# EasyEDA schematic SCH_AiO V4 Standard_2023-06-19.json

## Sheets
1 MAIN: TITLE: Sheet_1; REV: 1.0; Date: 2023-03-03; Sheet: 1/1; Drawn By: Richard Klasens; Company: Your Company
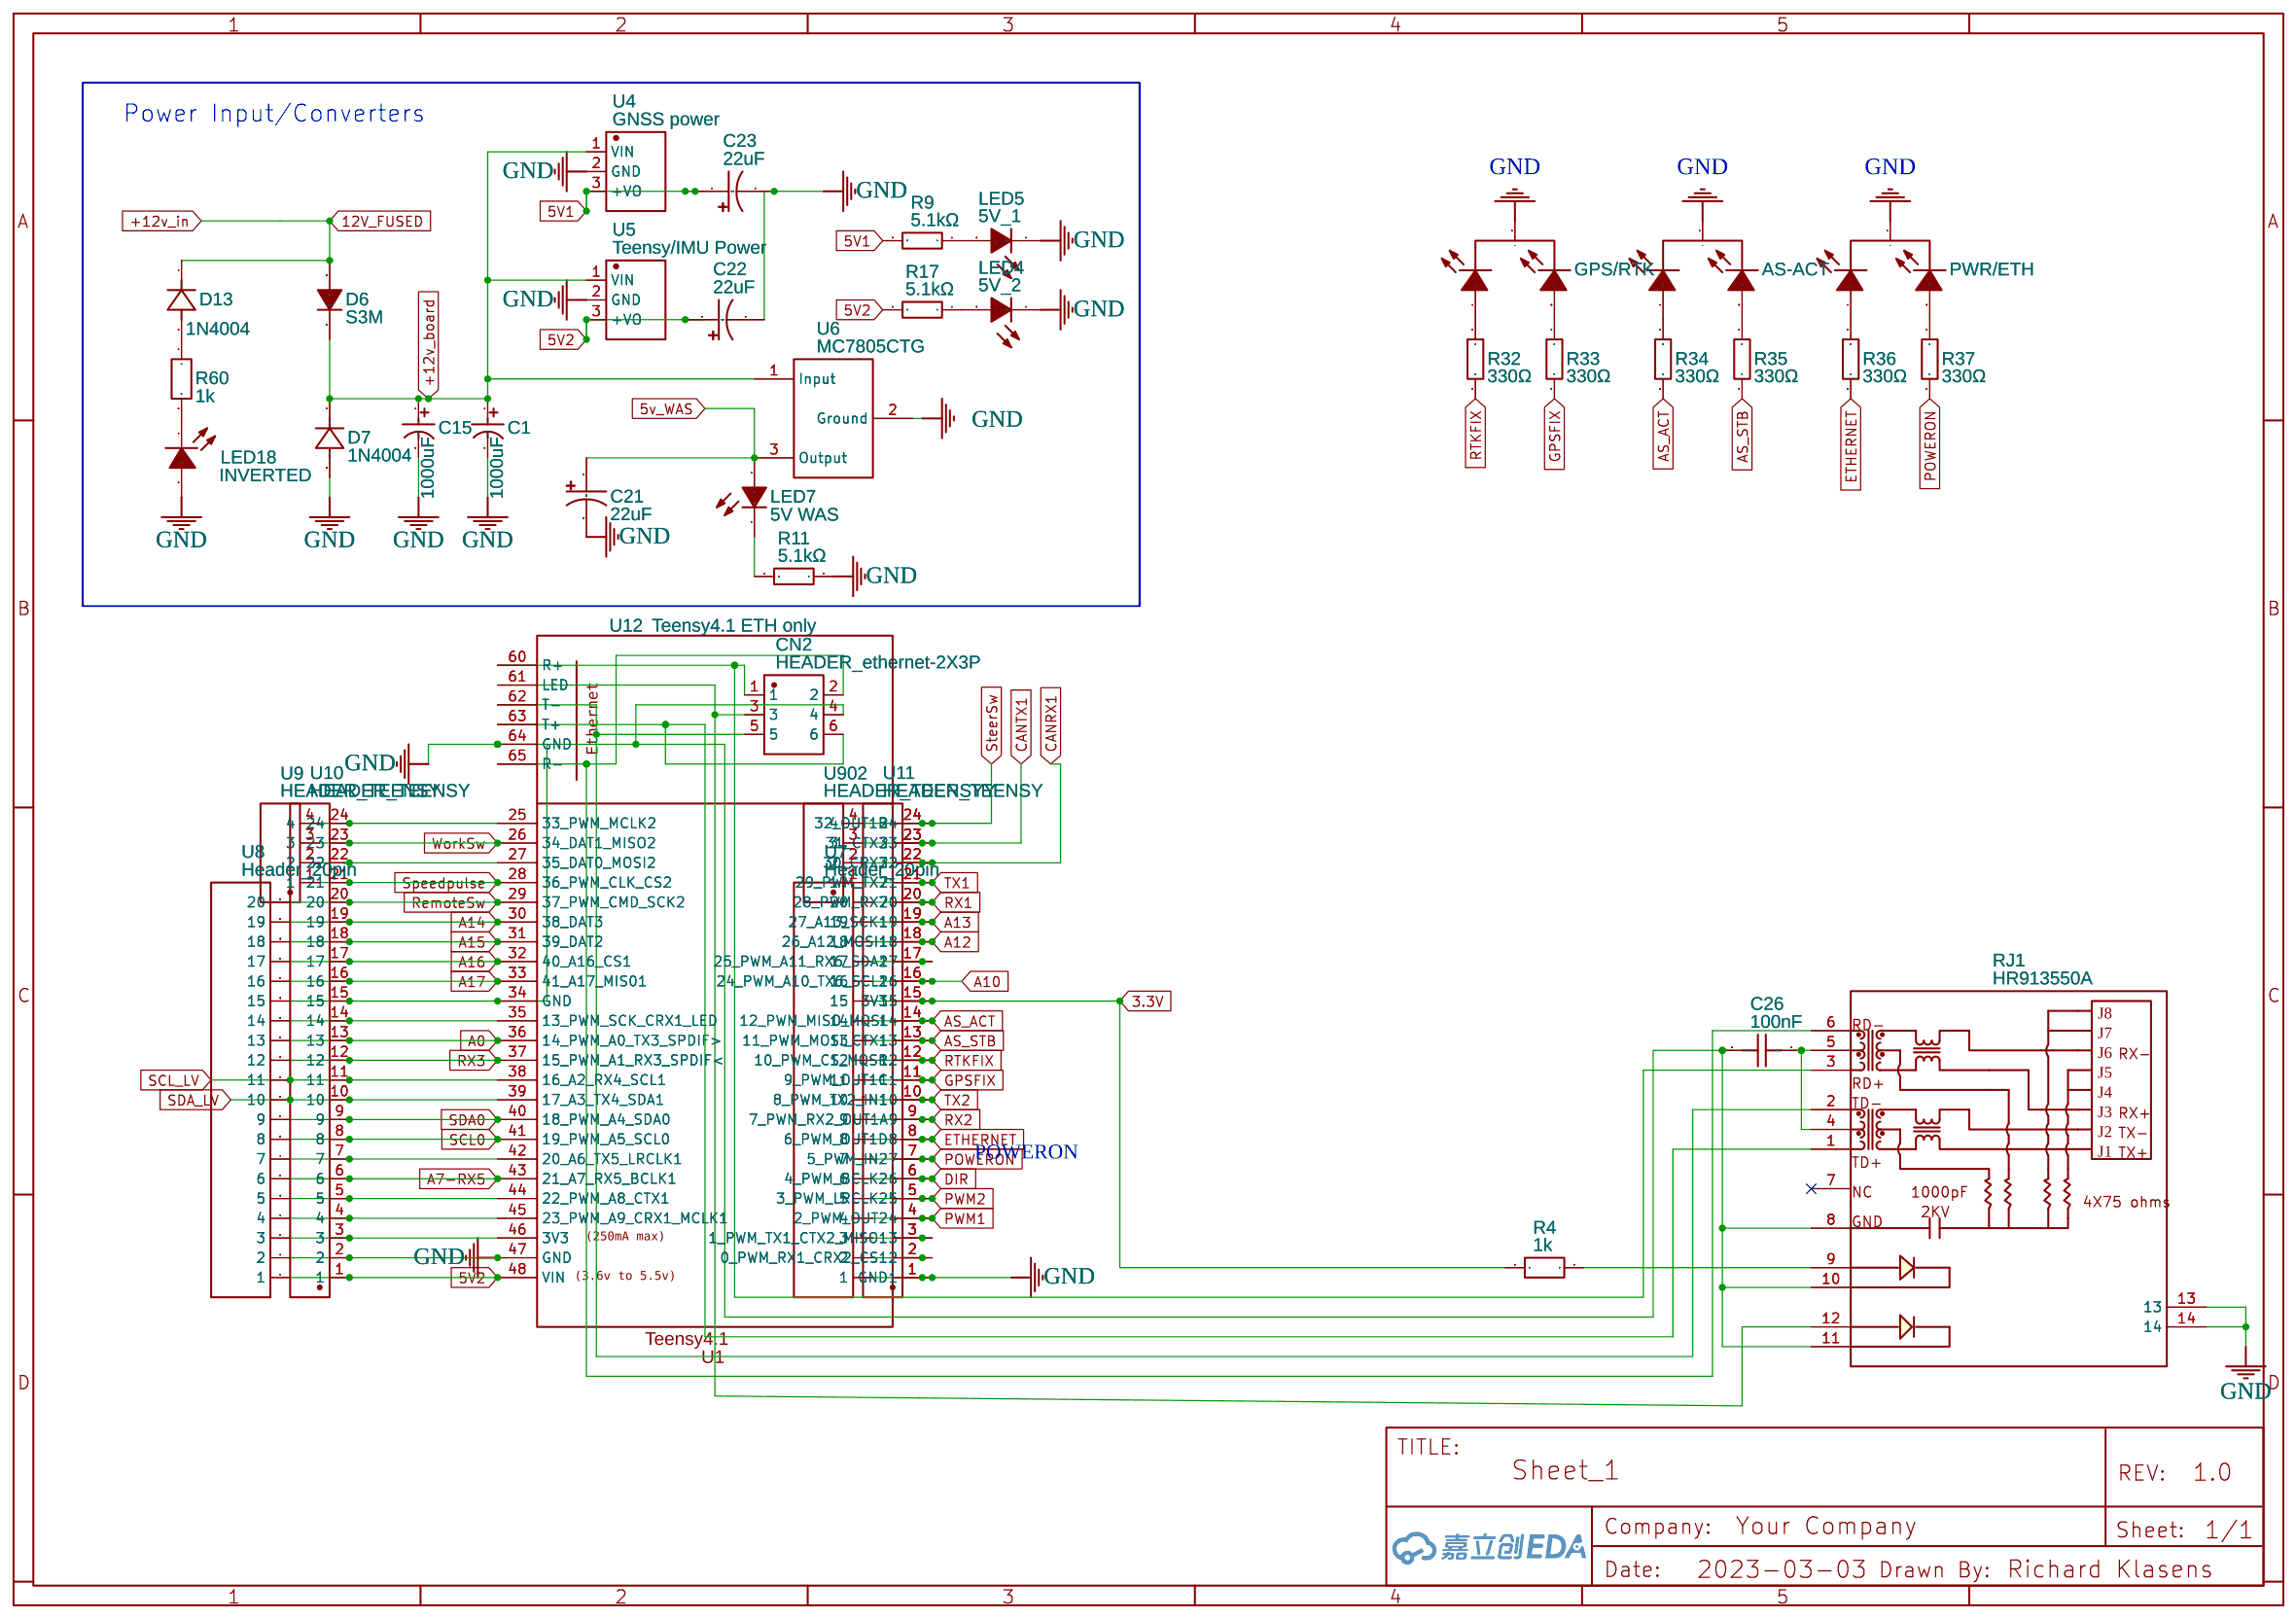
[diagram p0: MAIN]
2 WAS
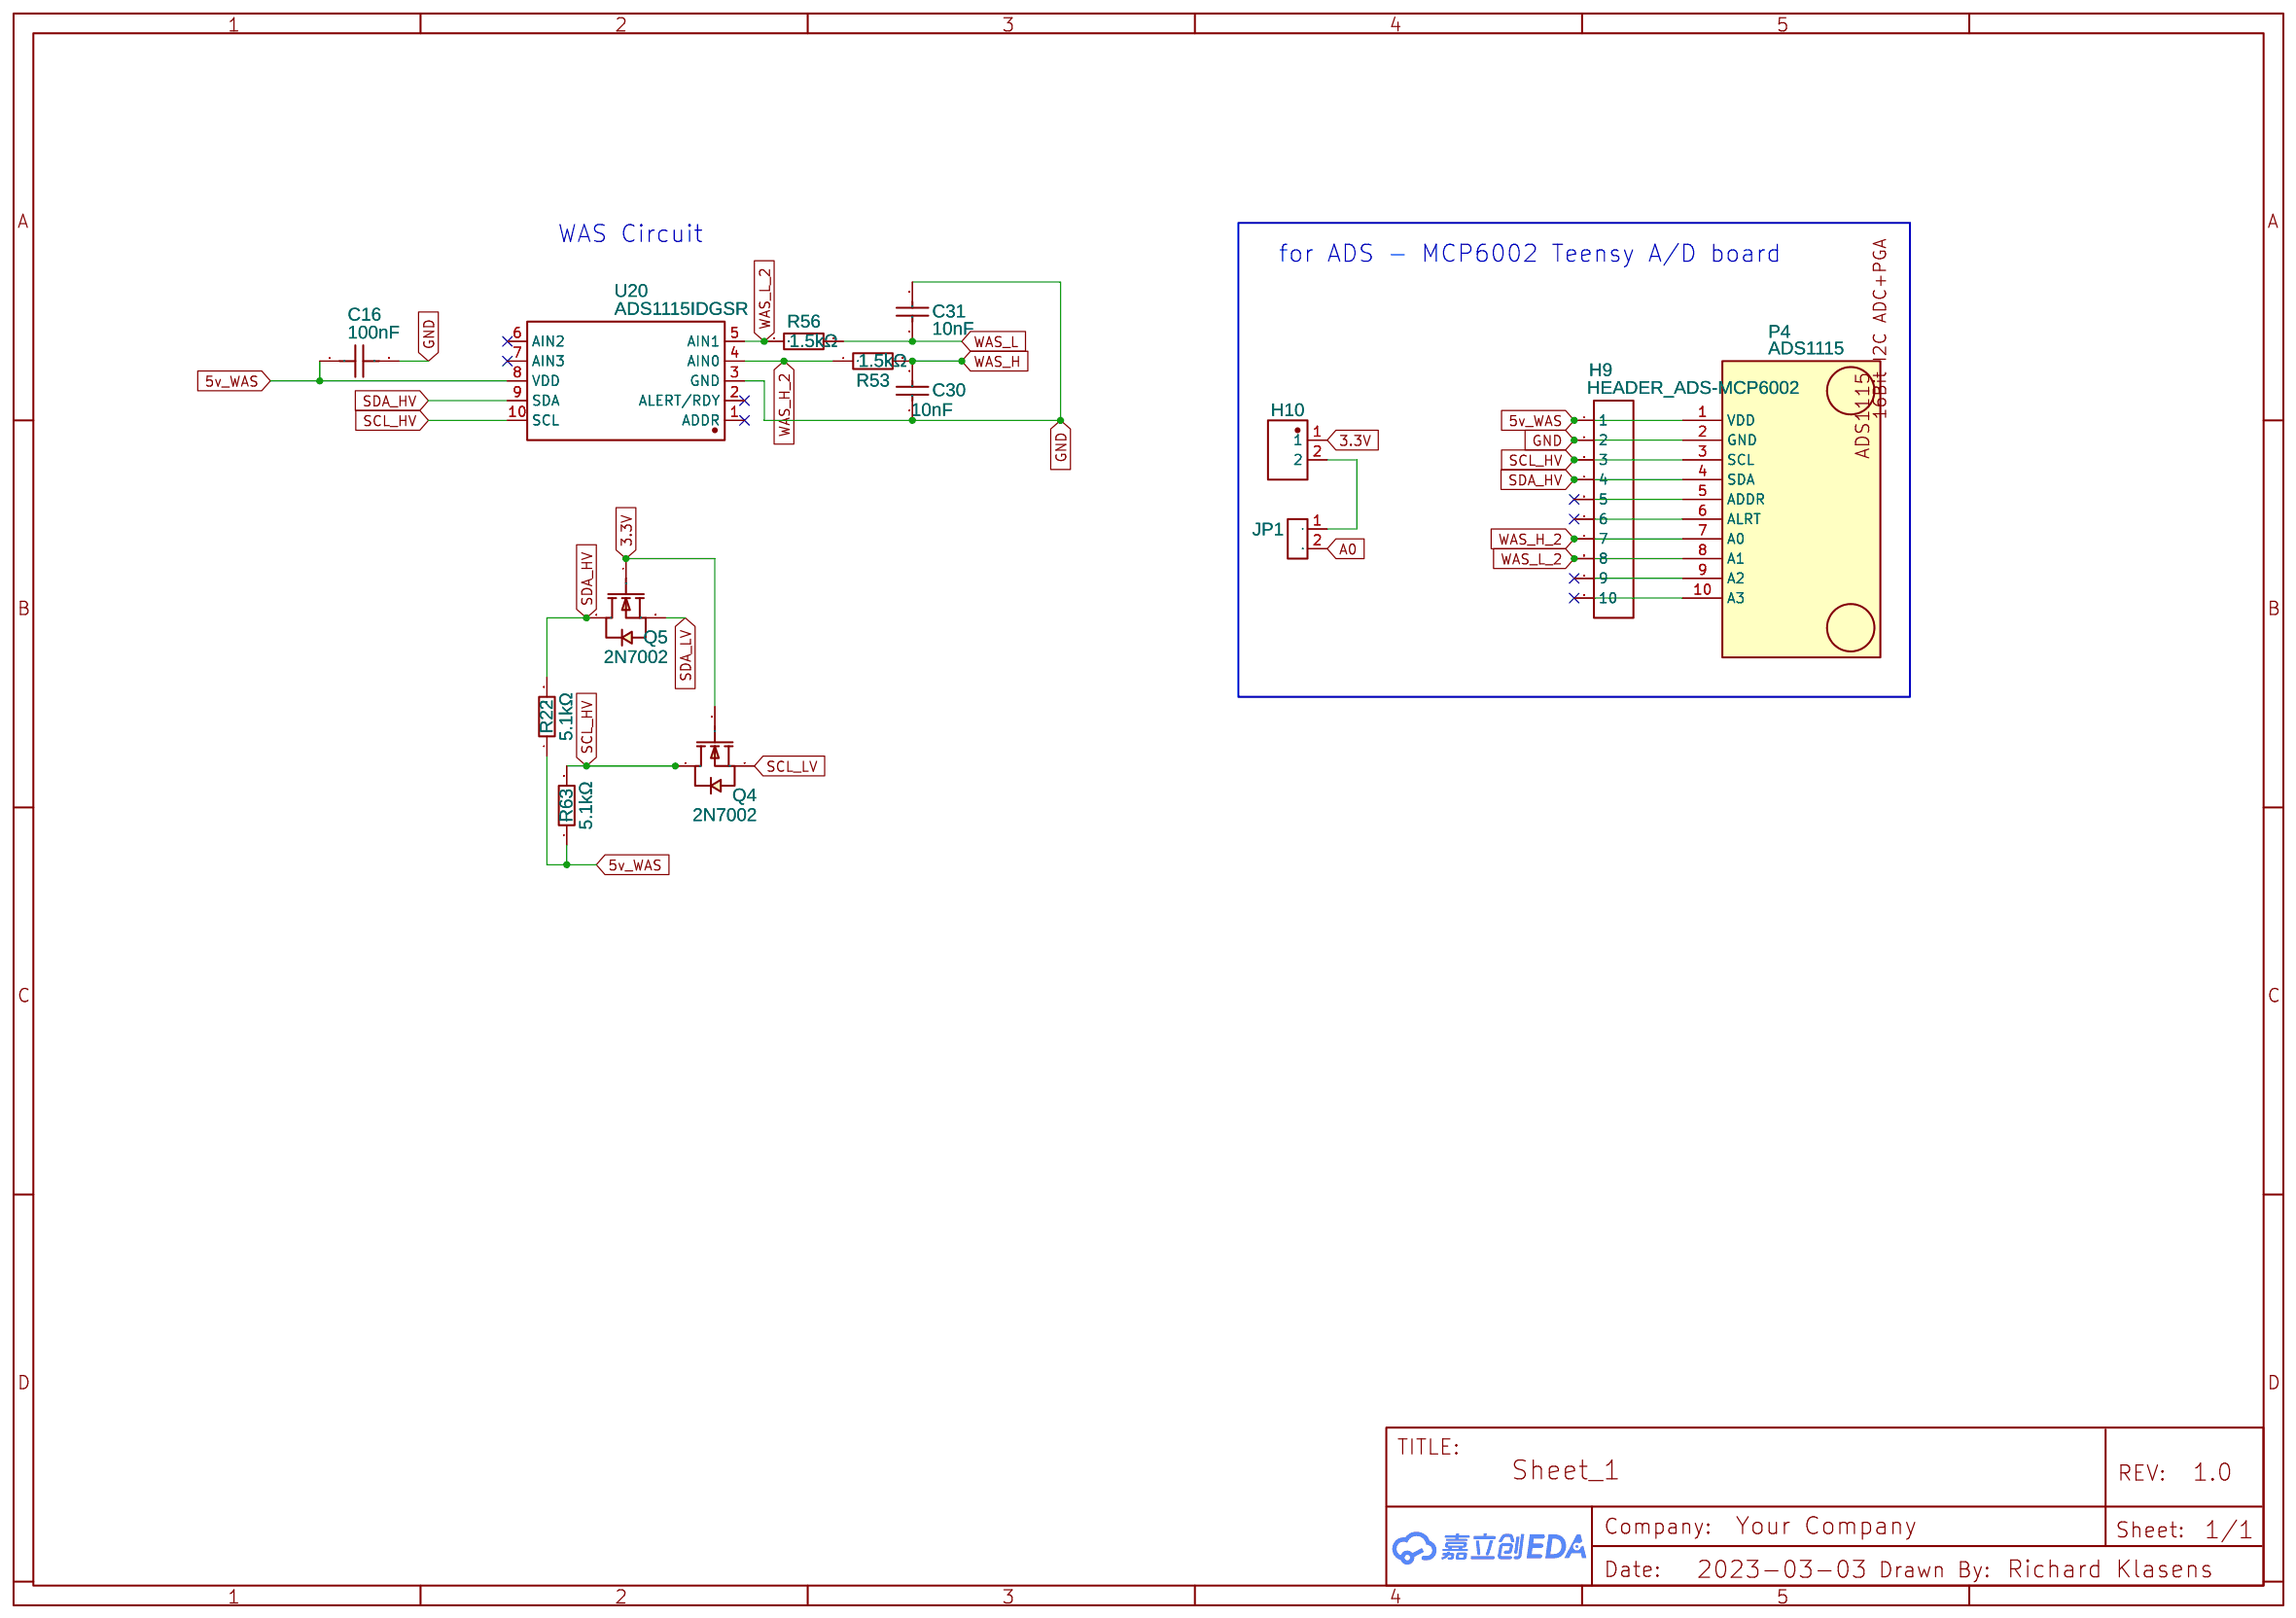
[diagram p1: WAS]
3 STEERING
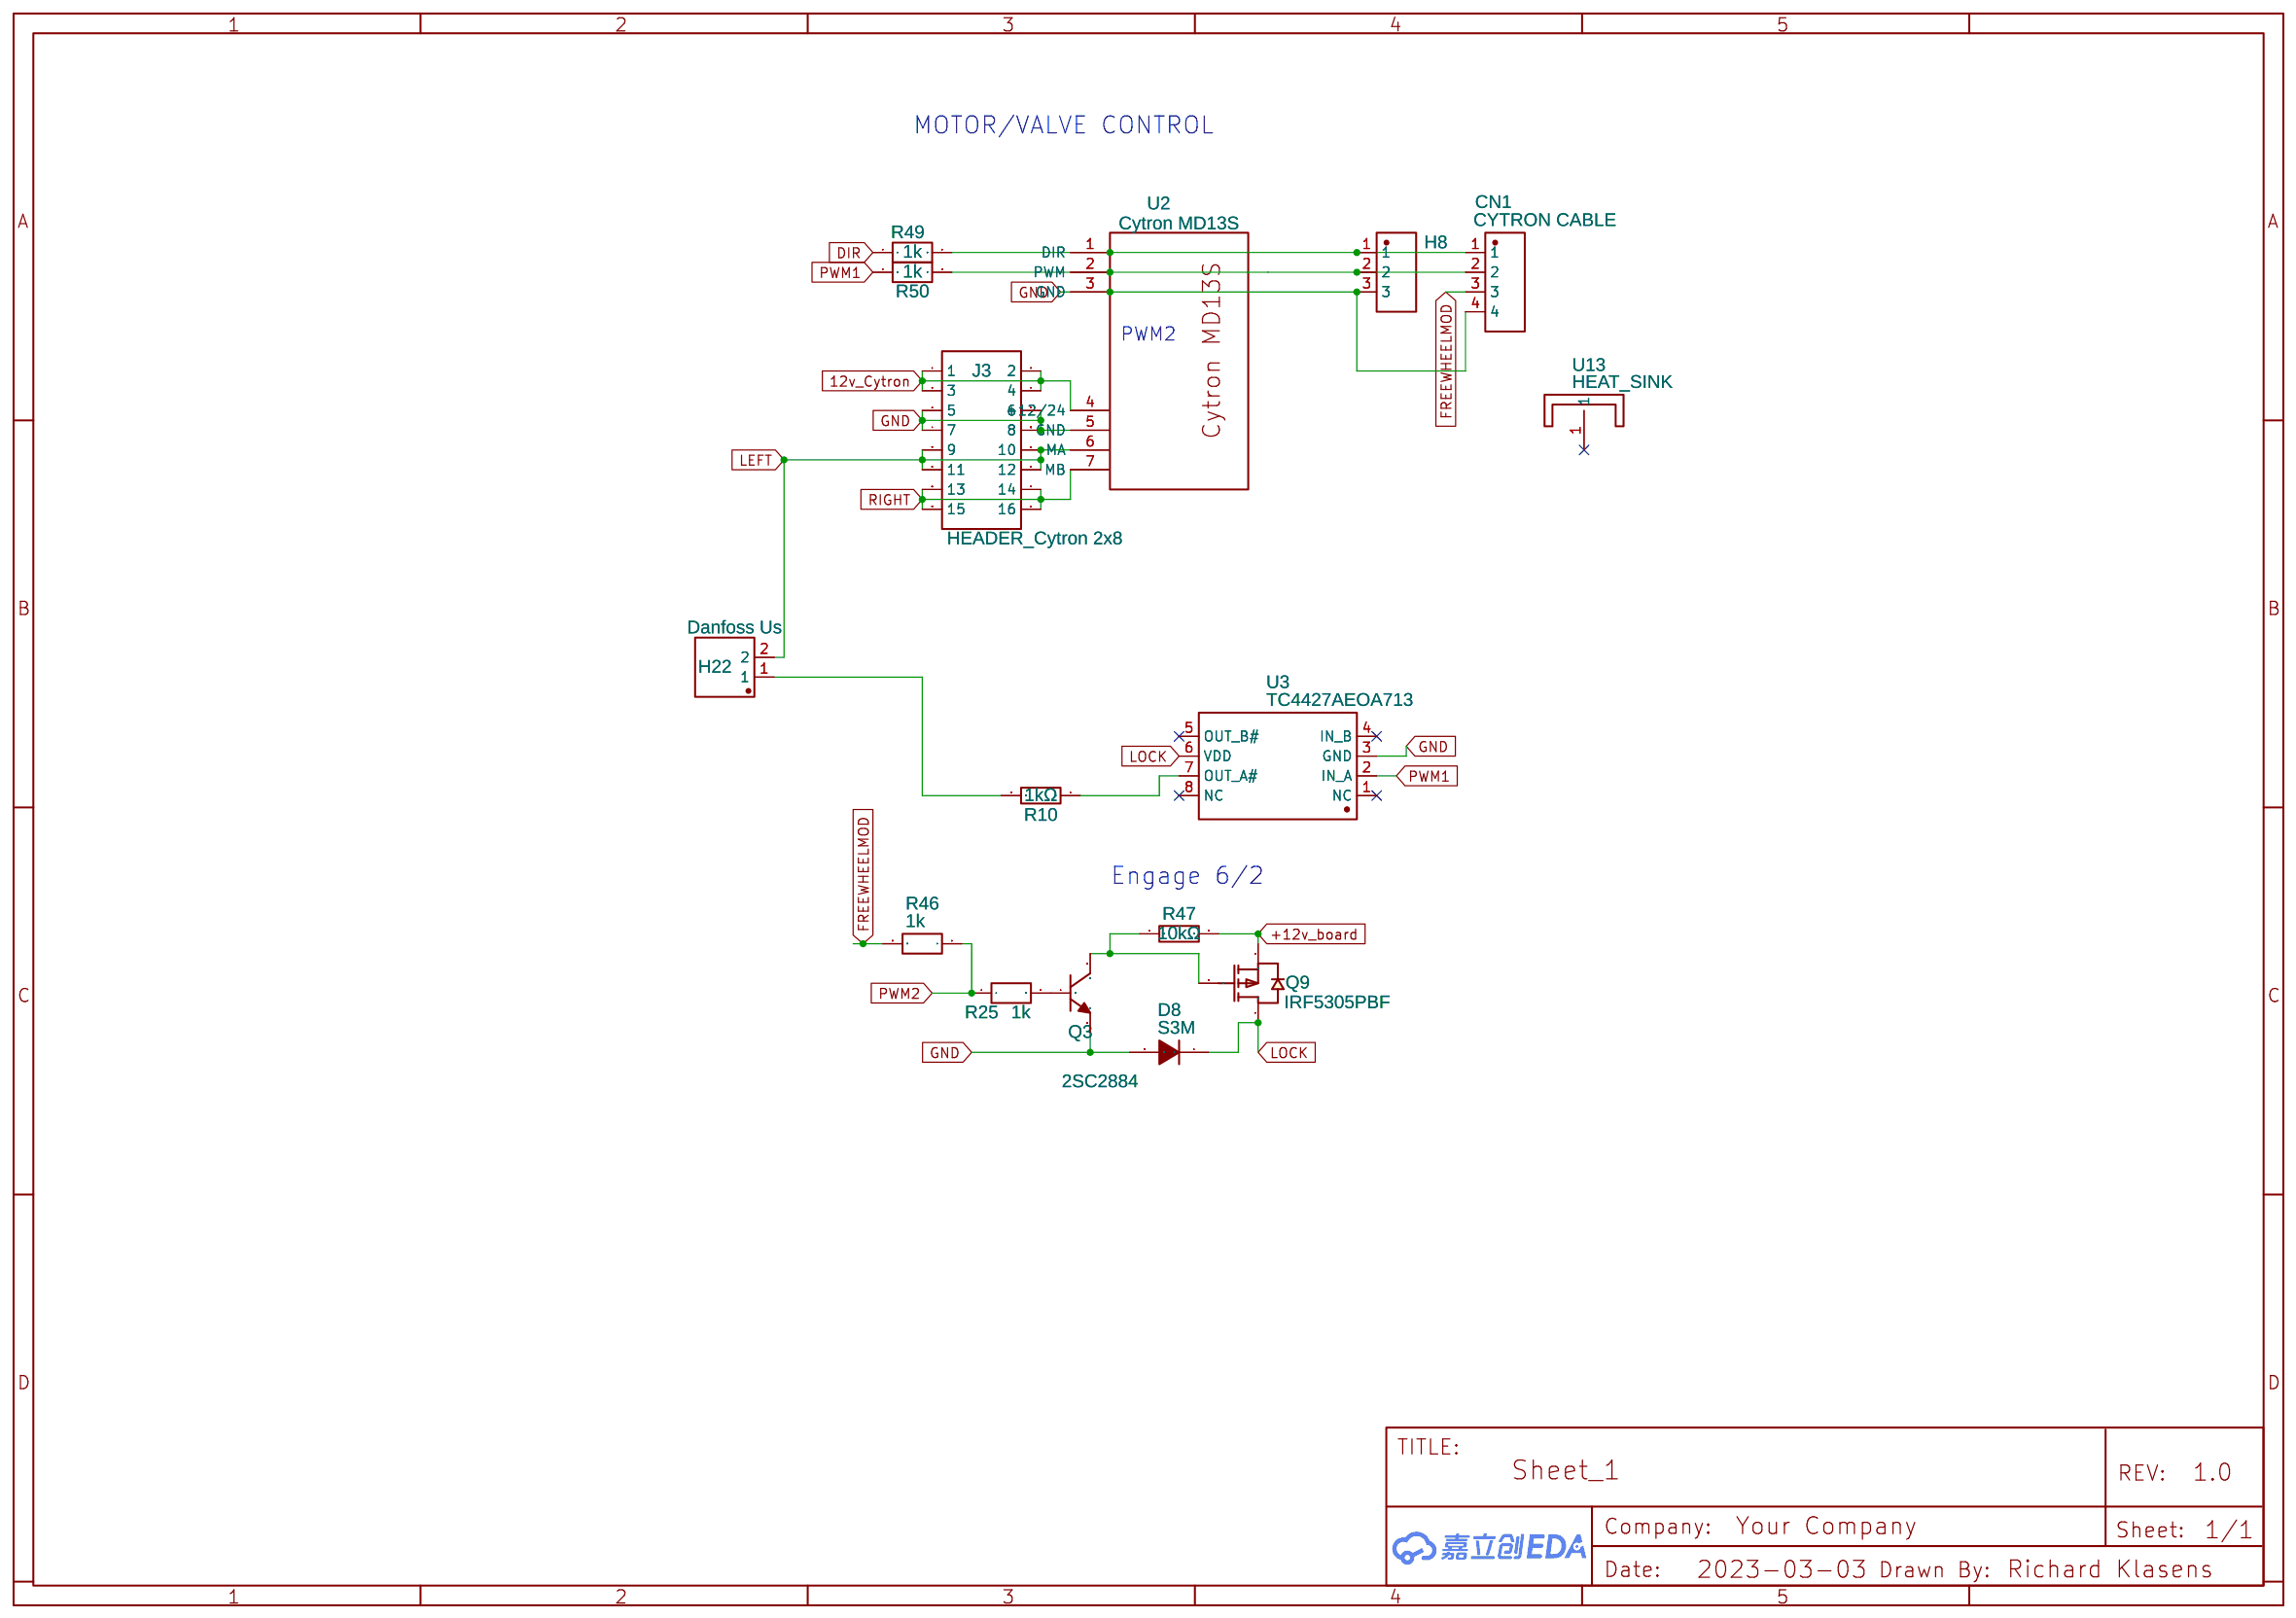
[diagram p2: STEERING]
4 IMU
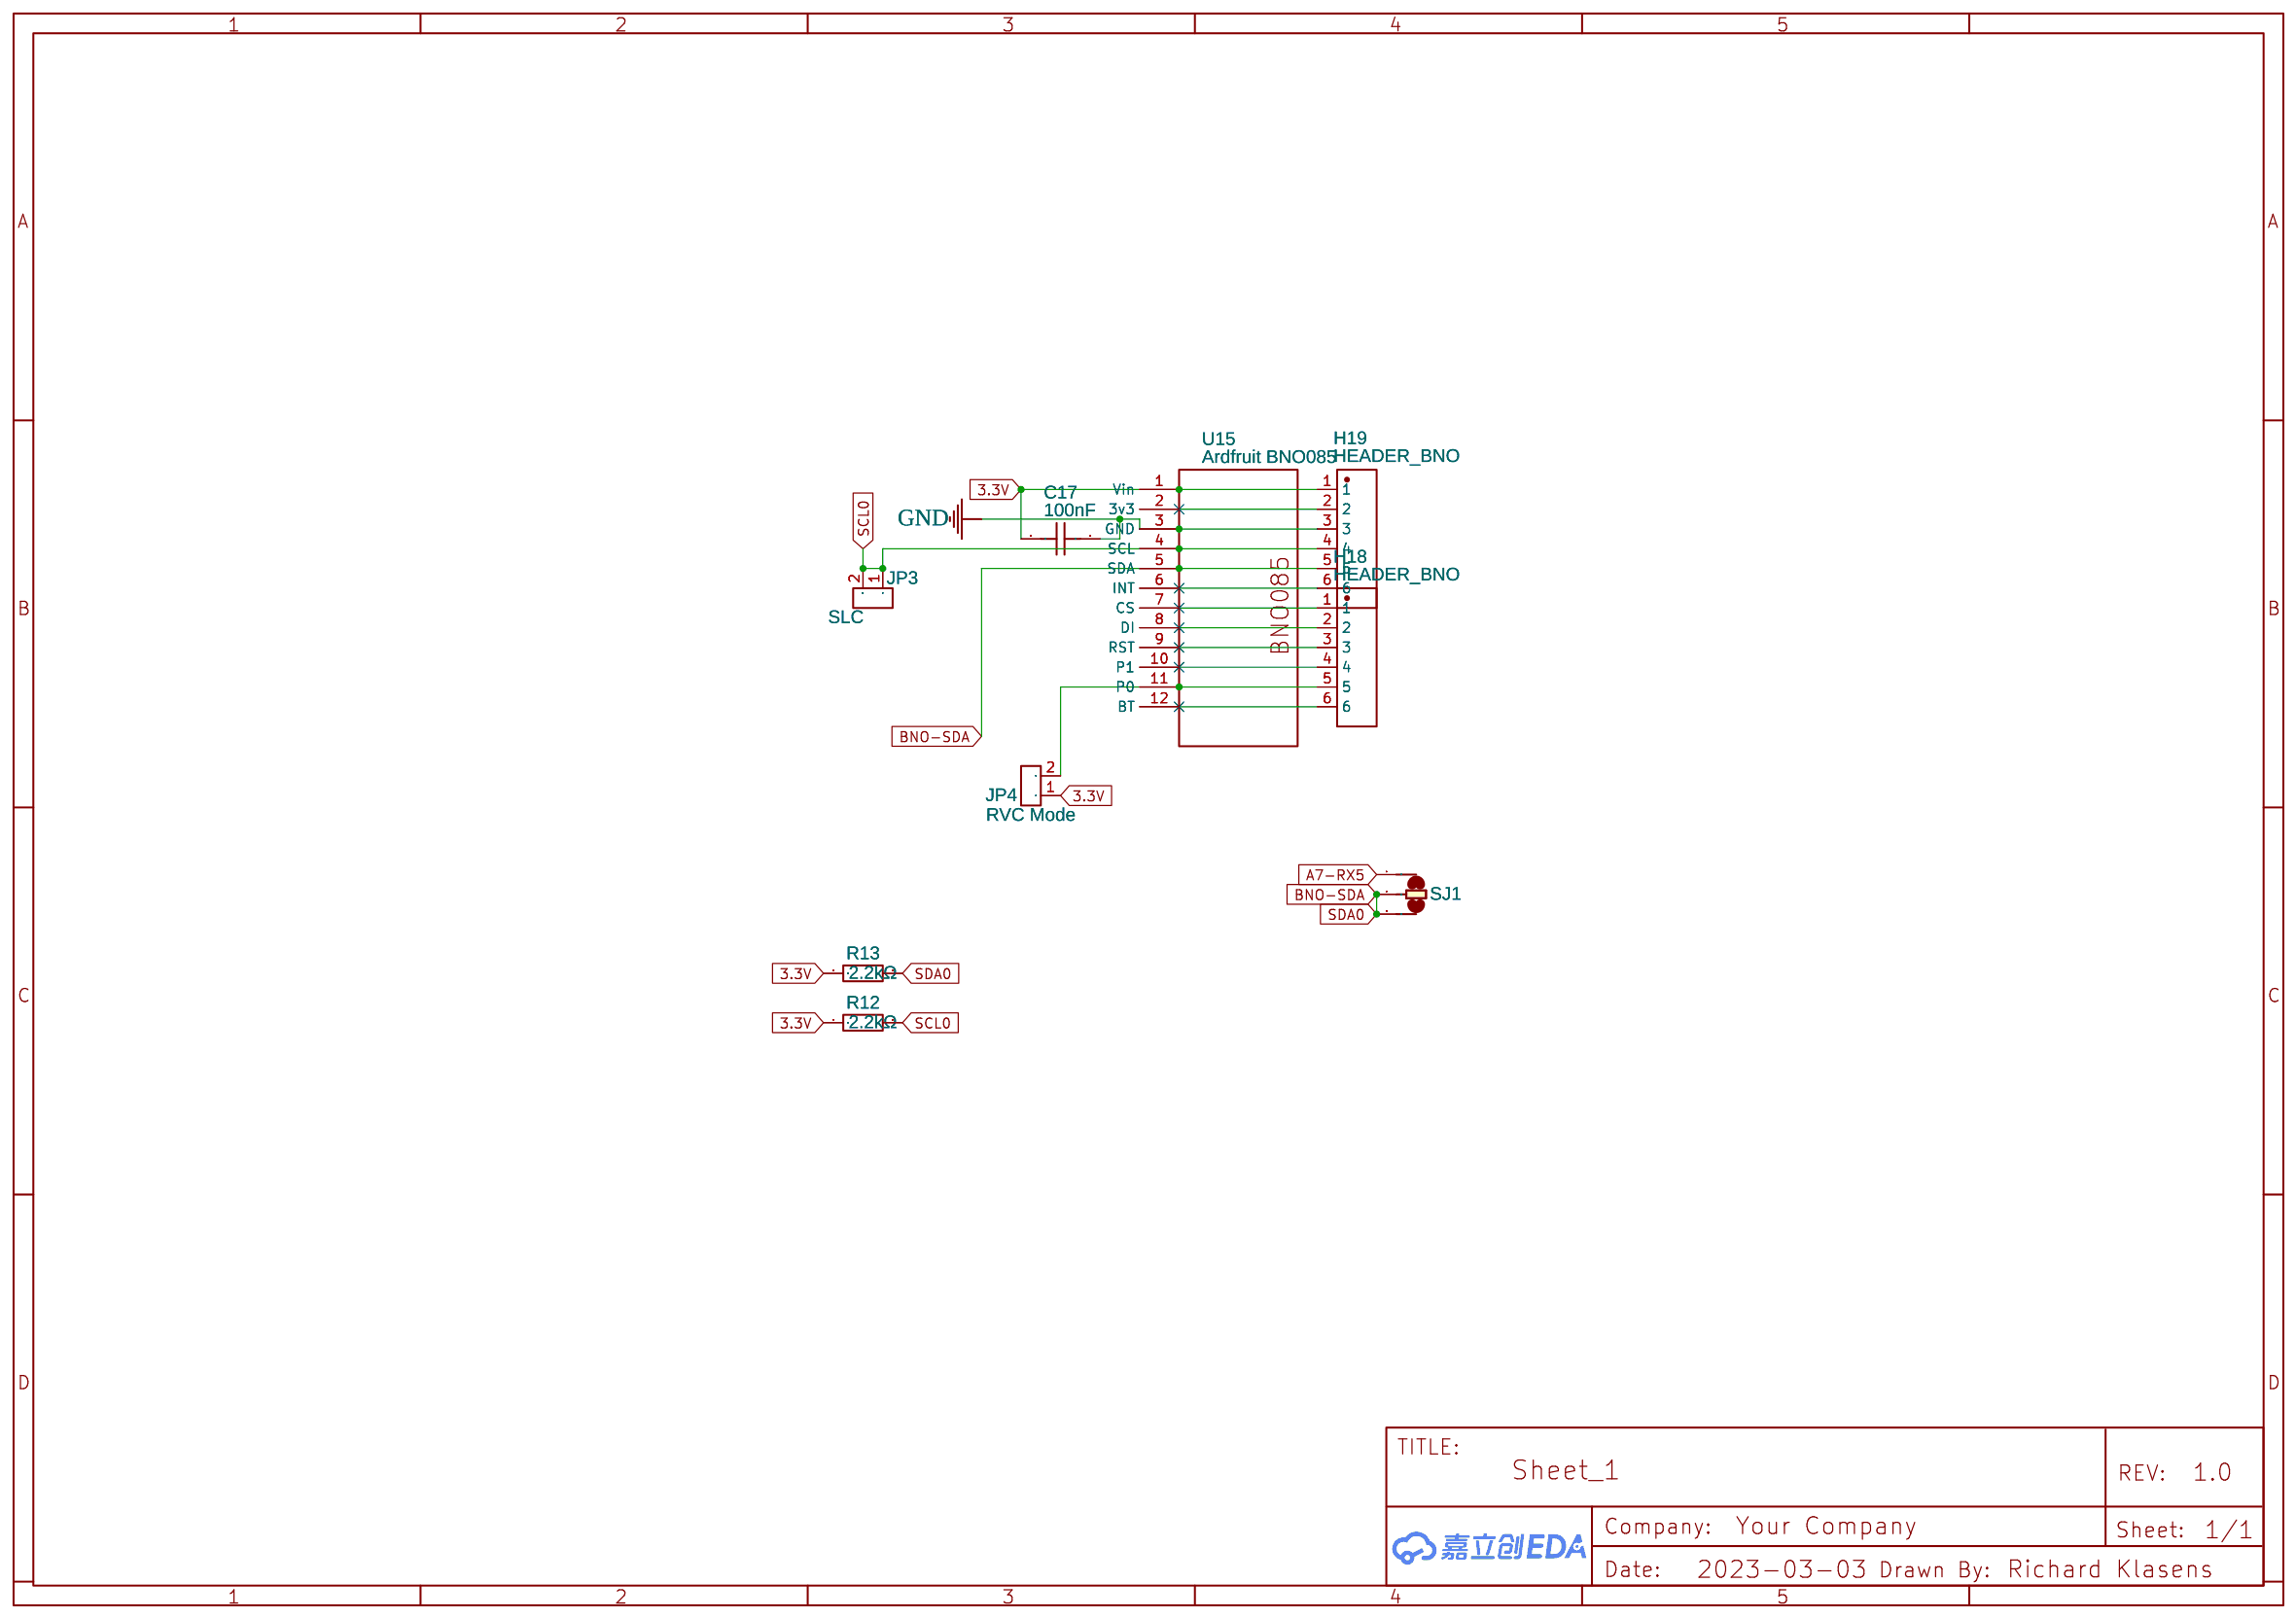
[diagram p3: IMU]
5 GPS
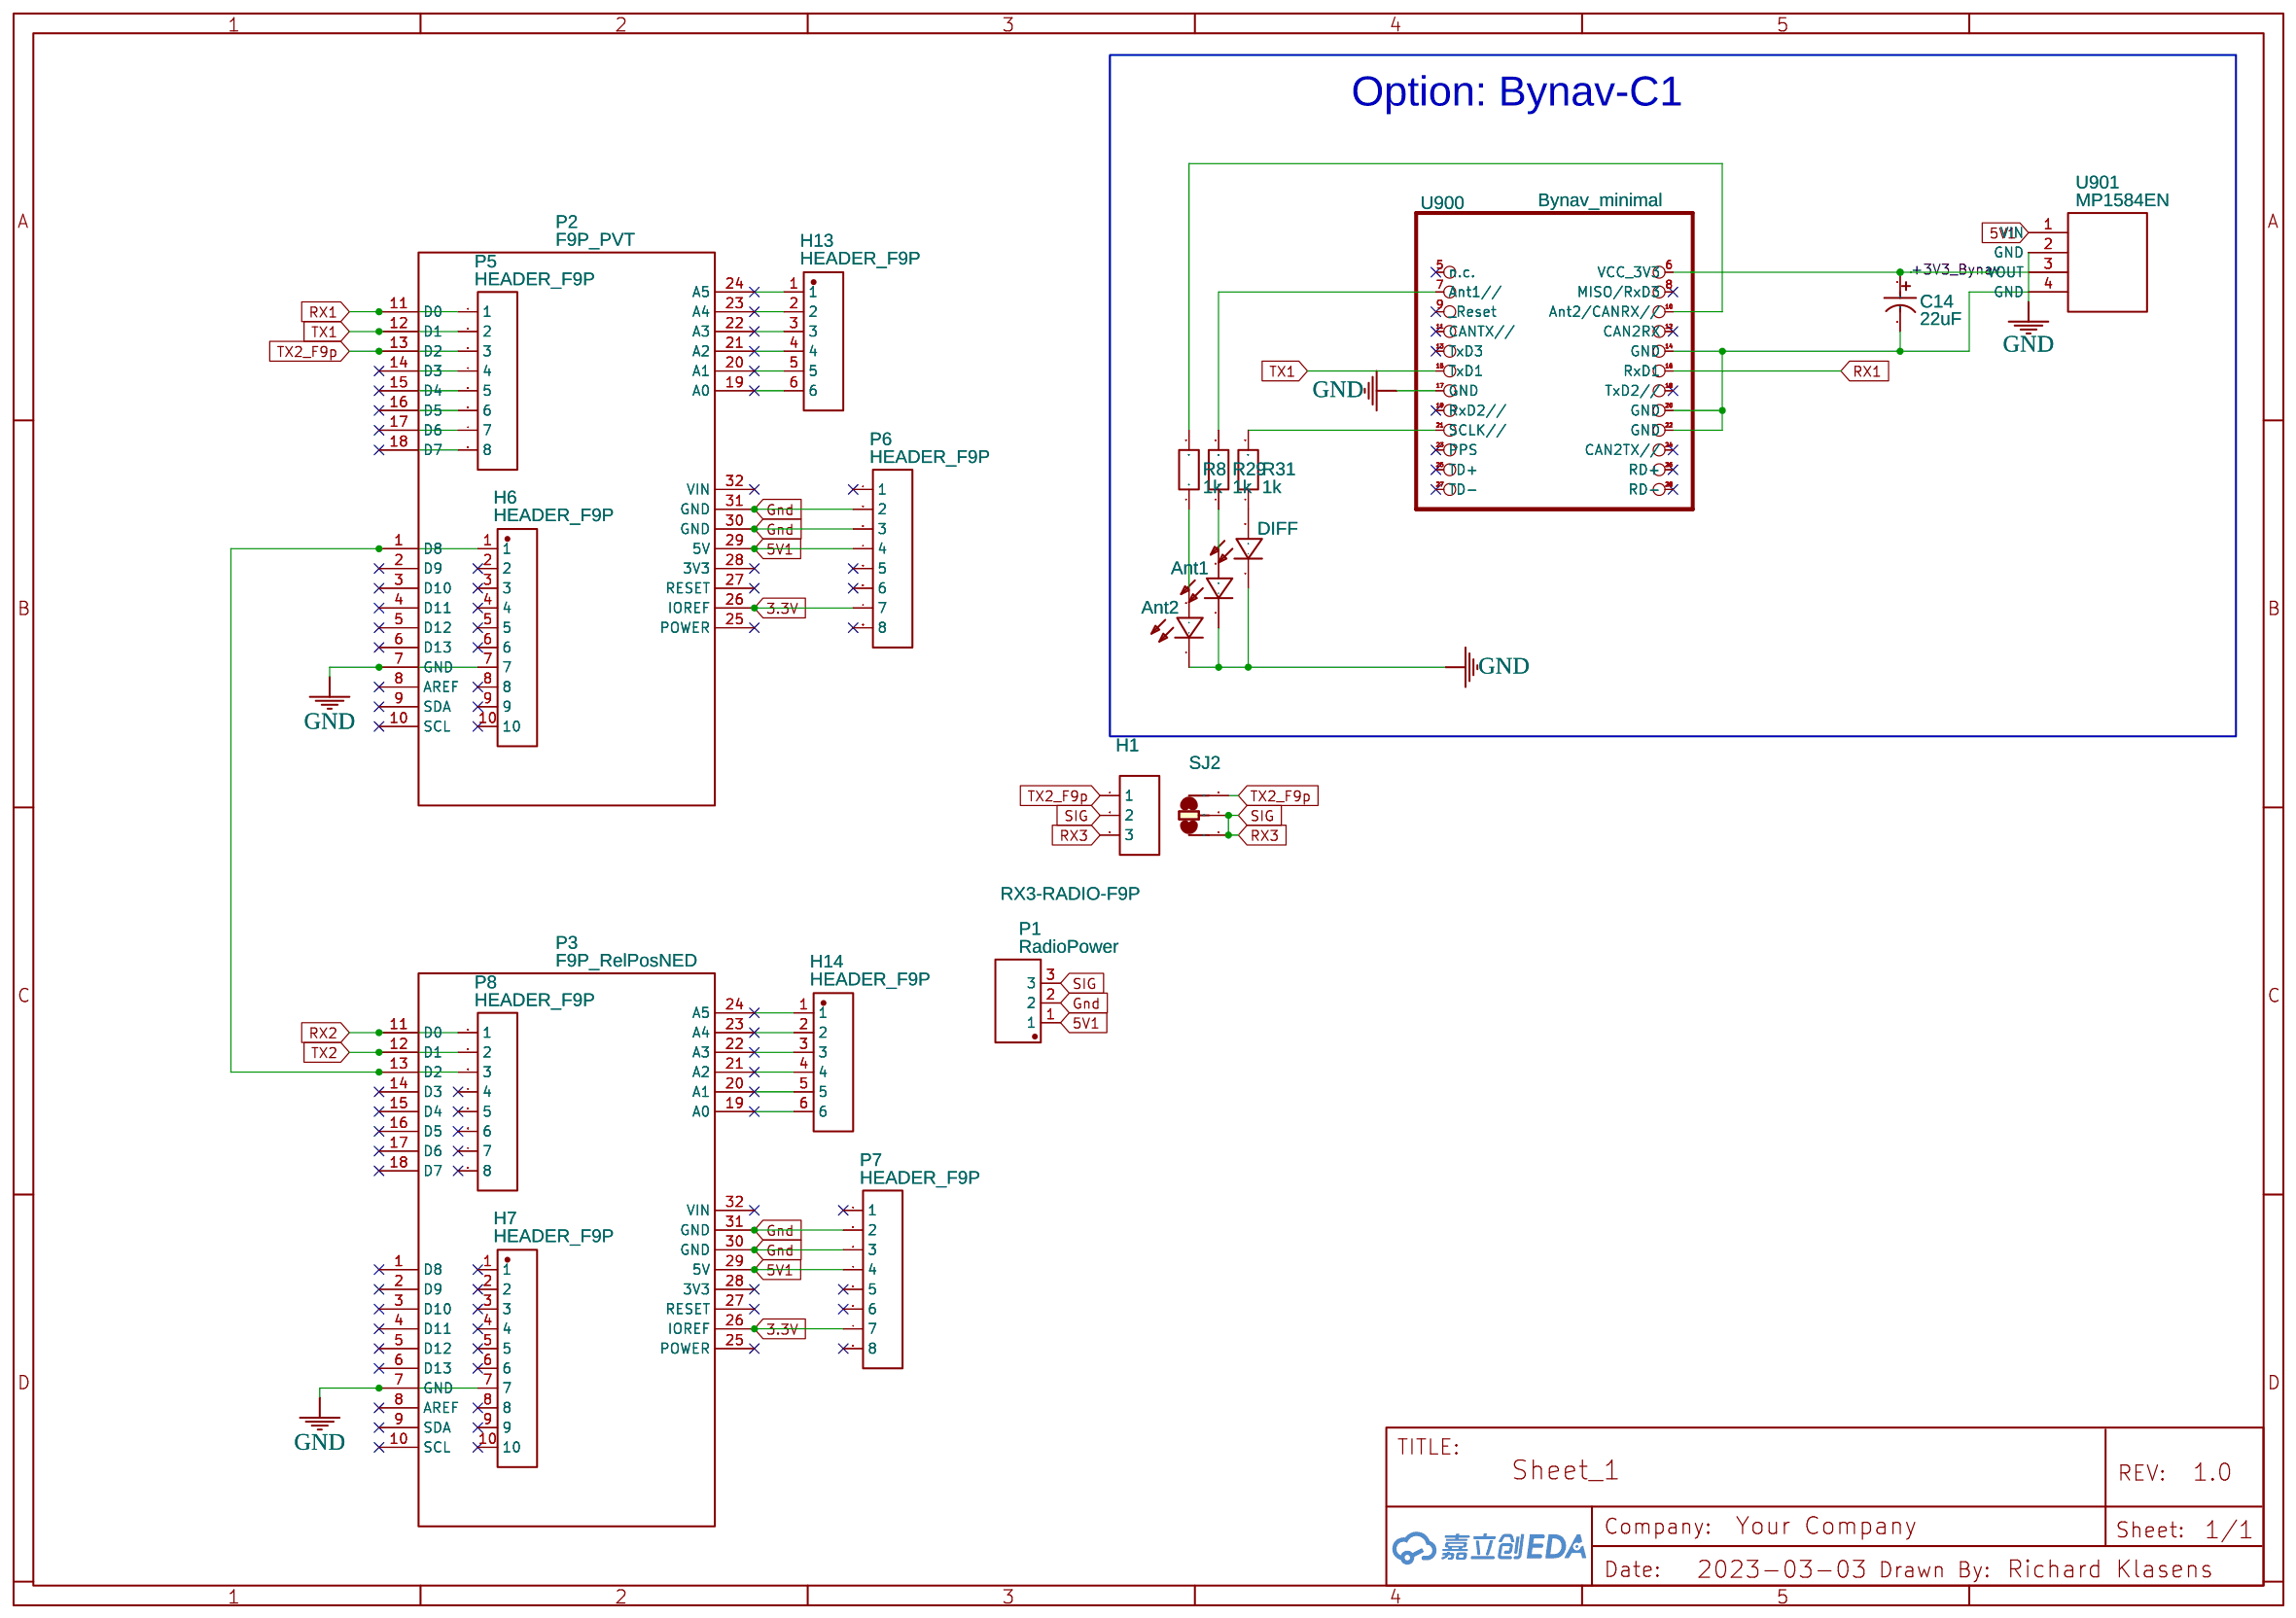
[diagram p4: GPS]
6 IO
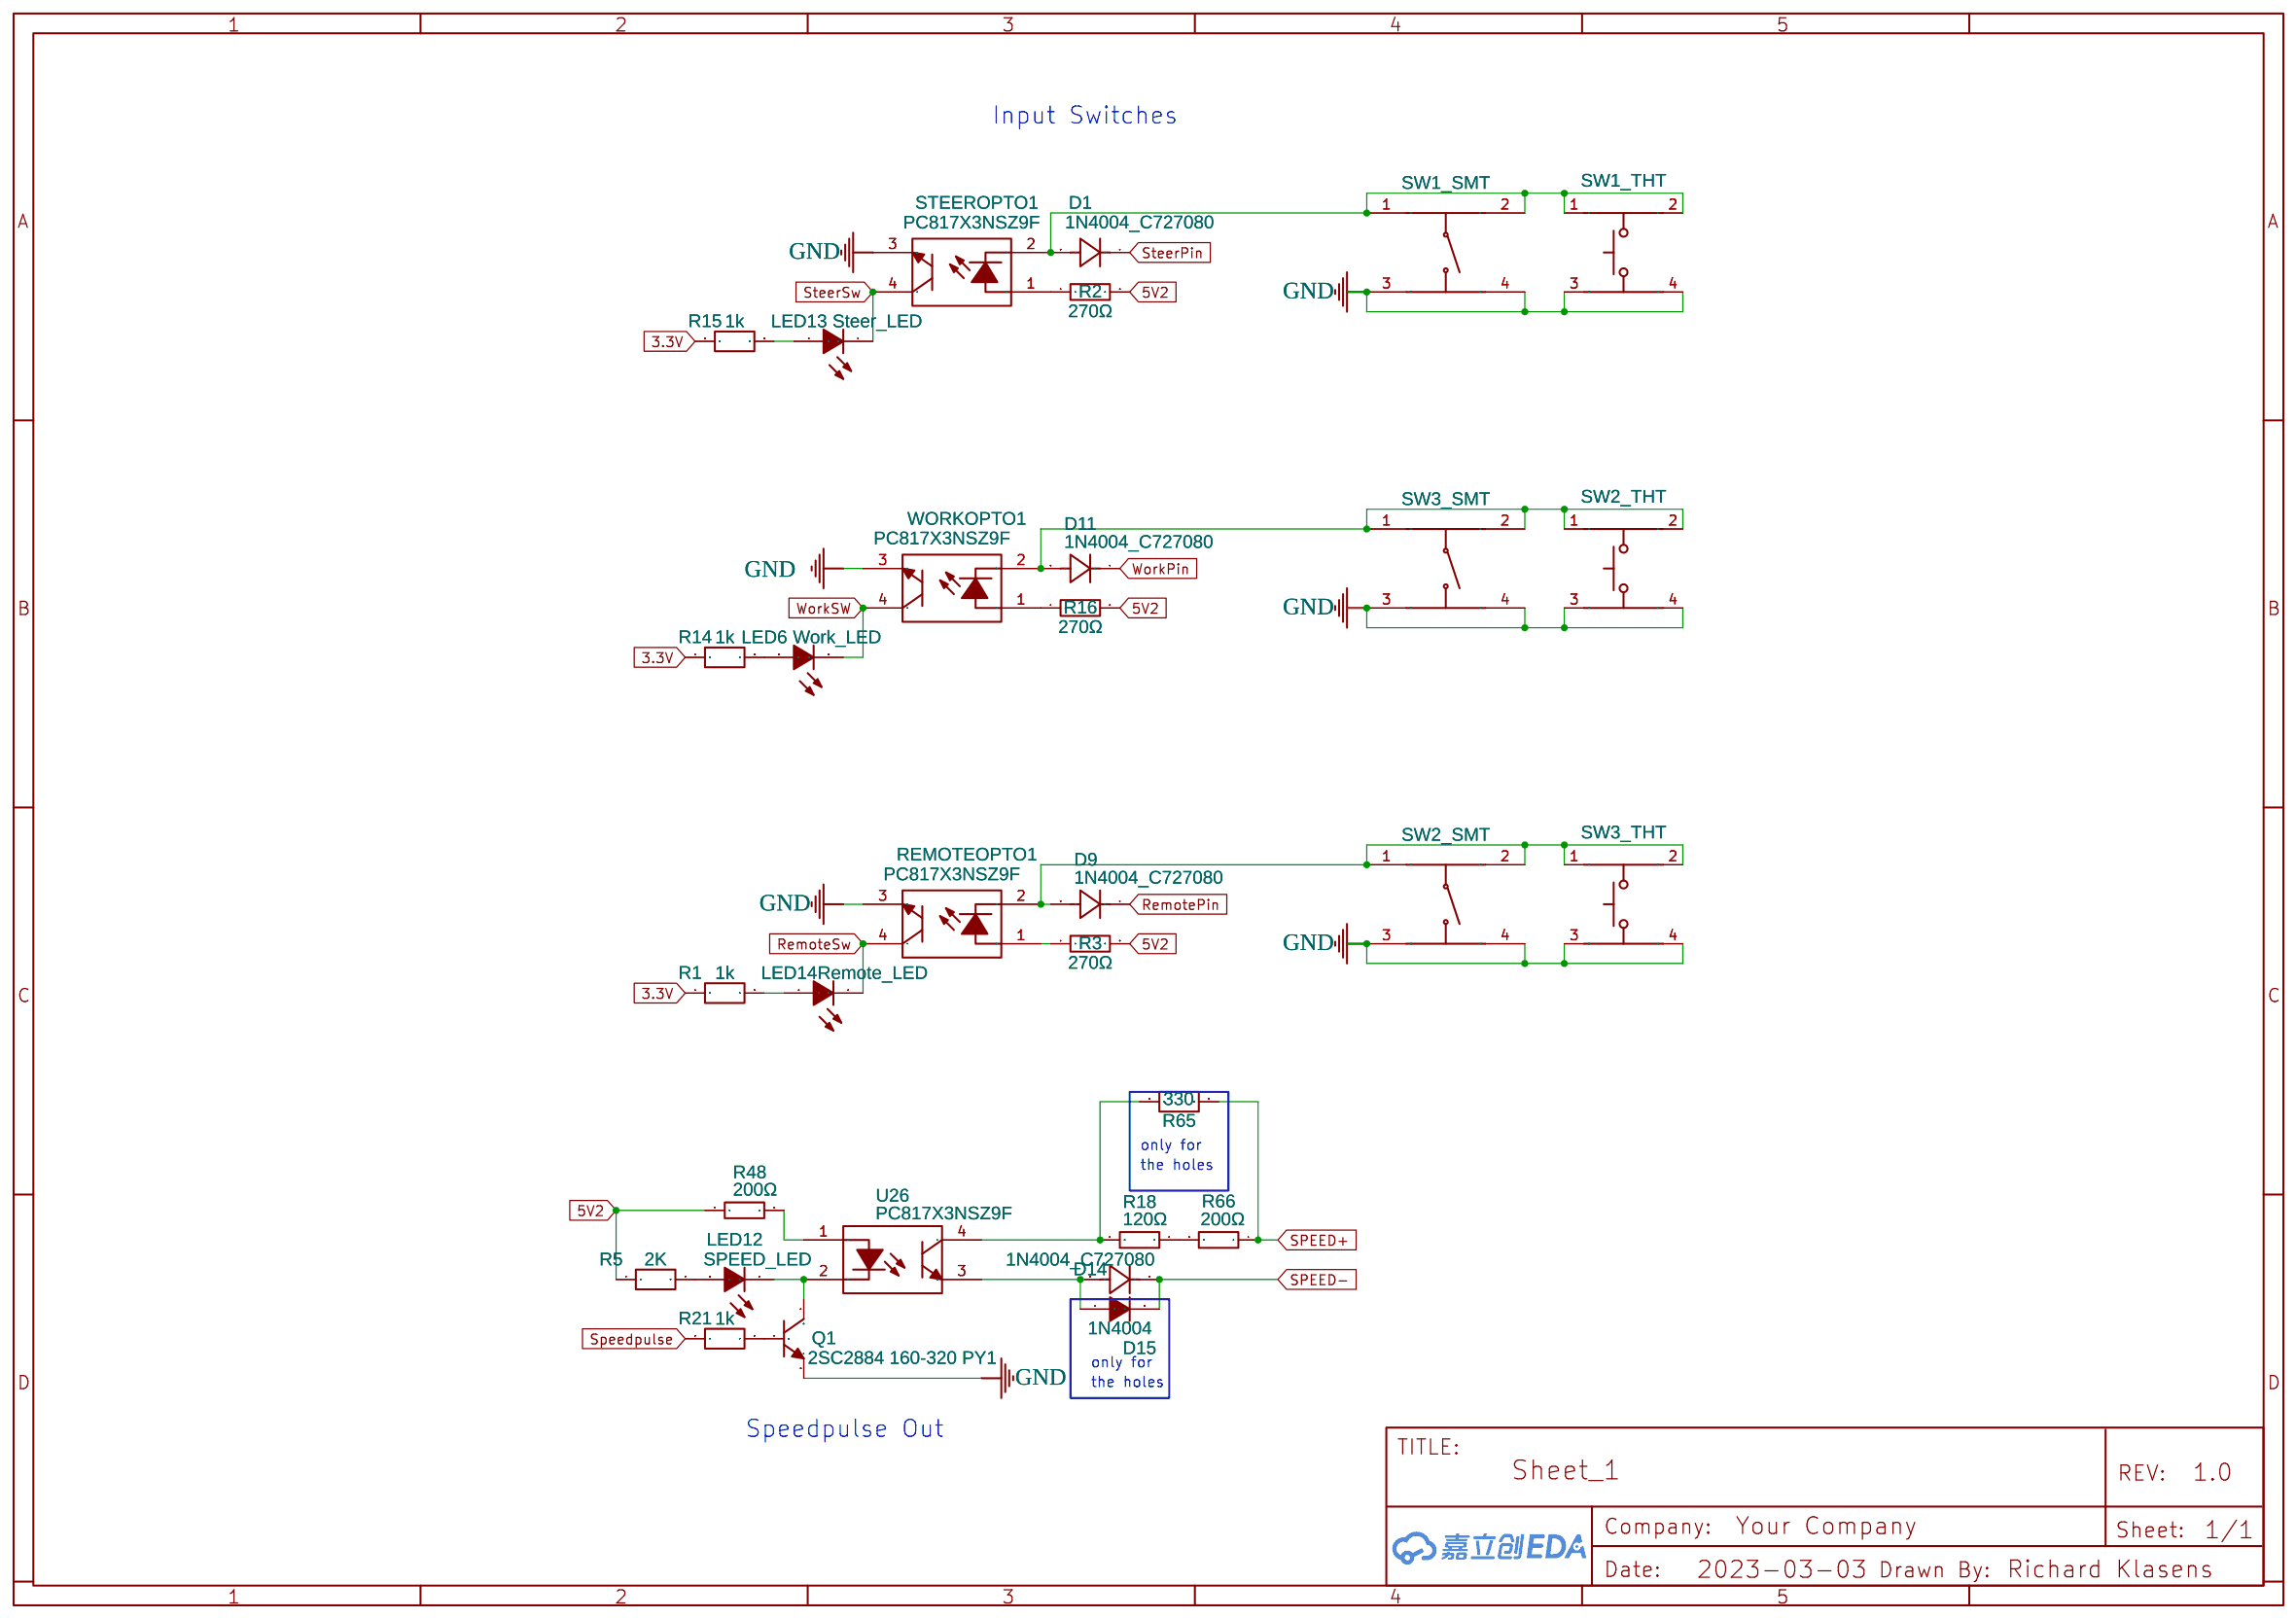
[diagram p5: IO]
7 CONNECTORS
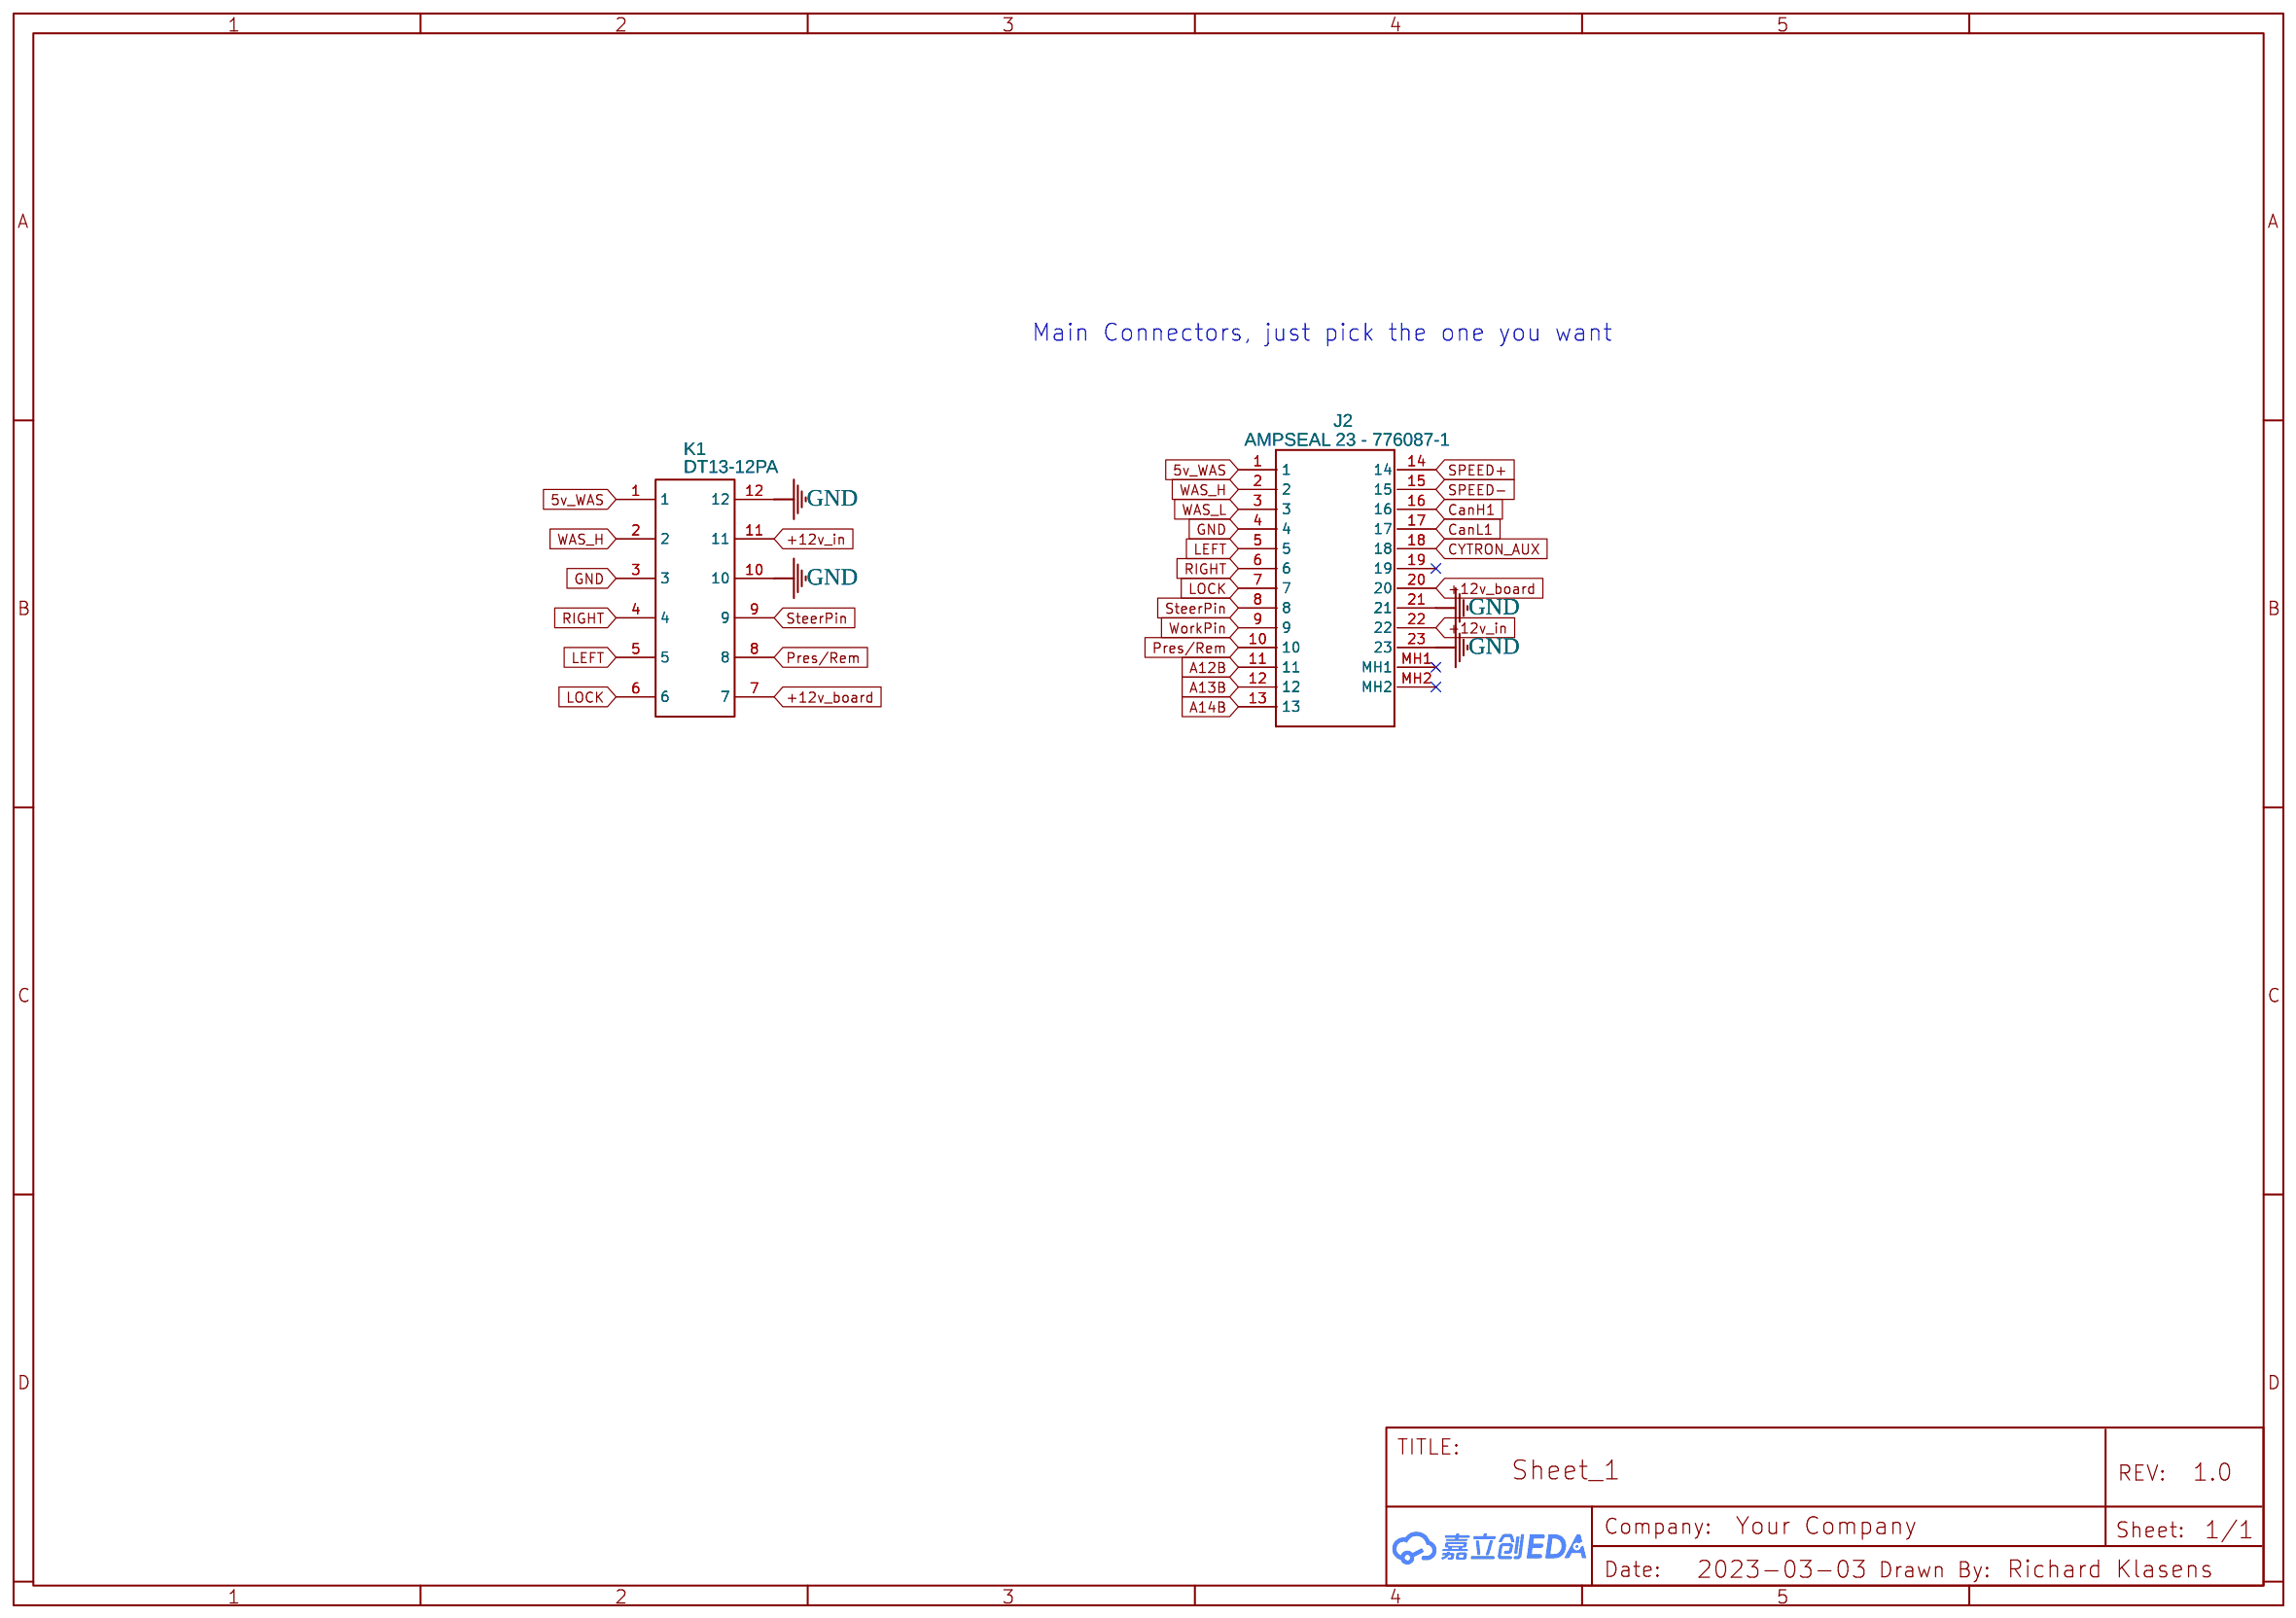
[diagram p6: CONNECTORS]
8 CANBUS
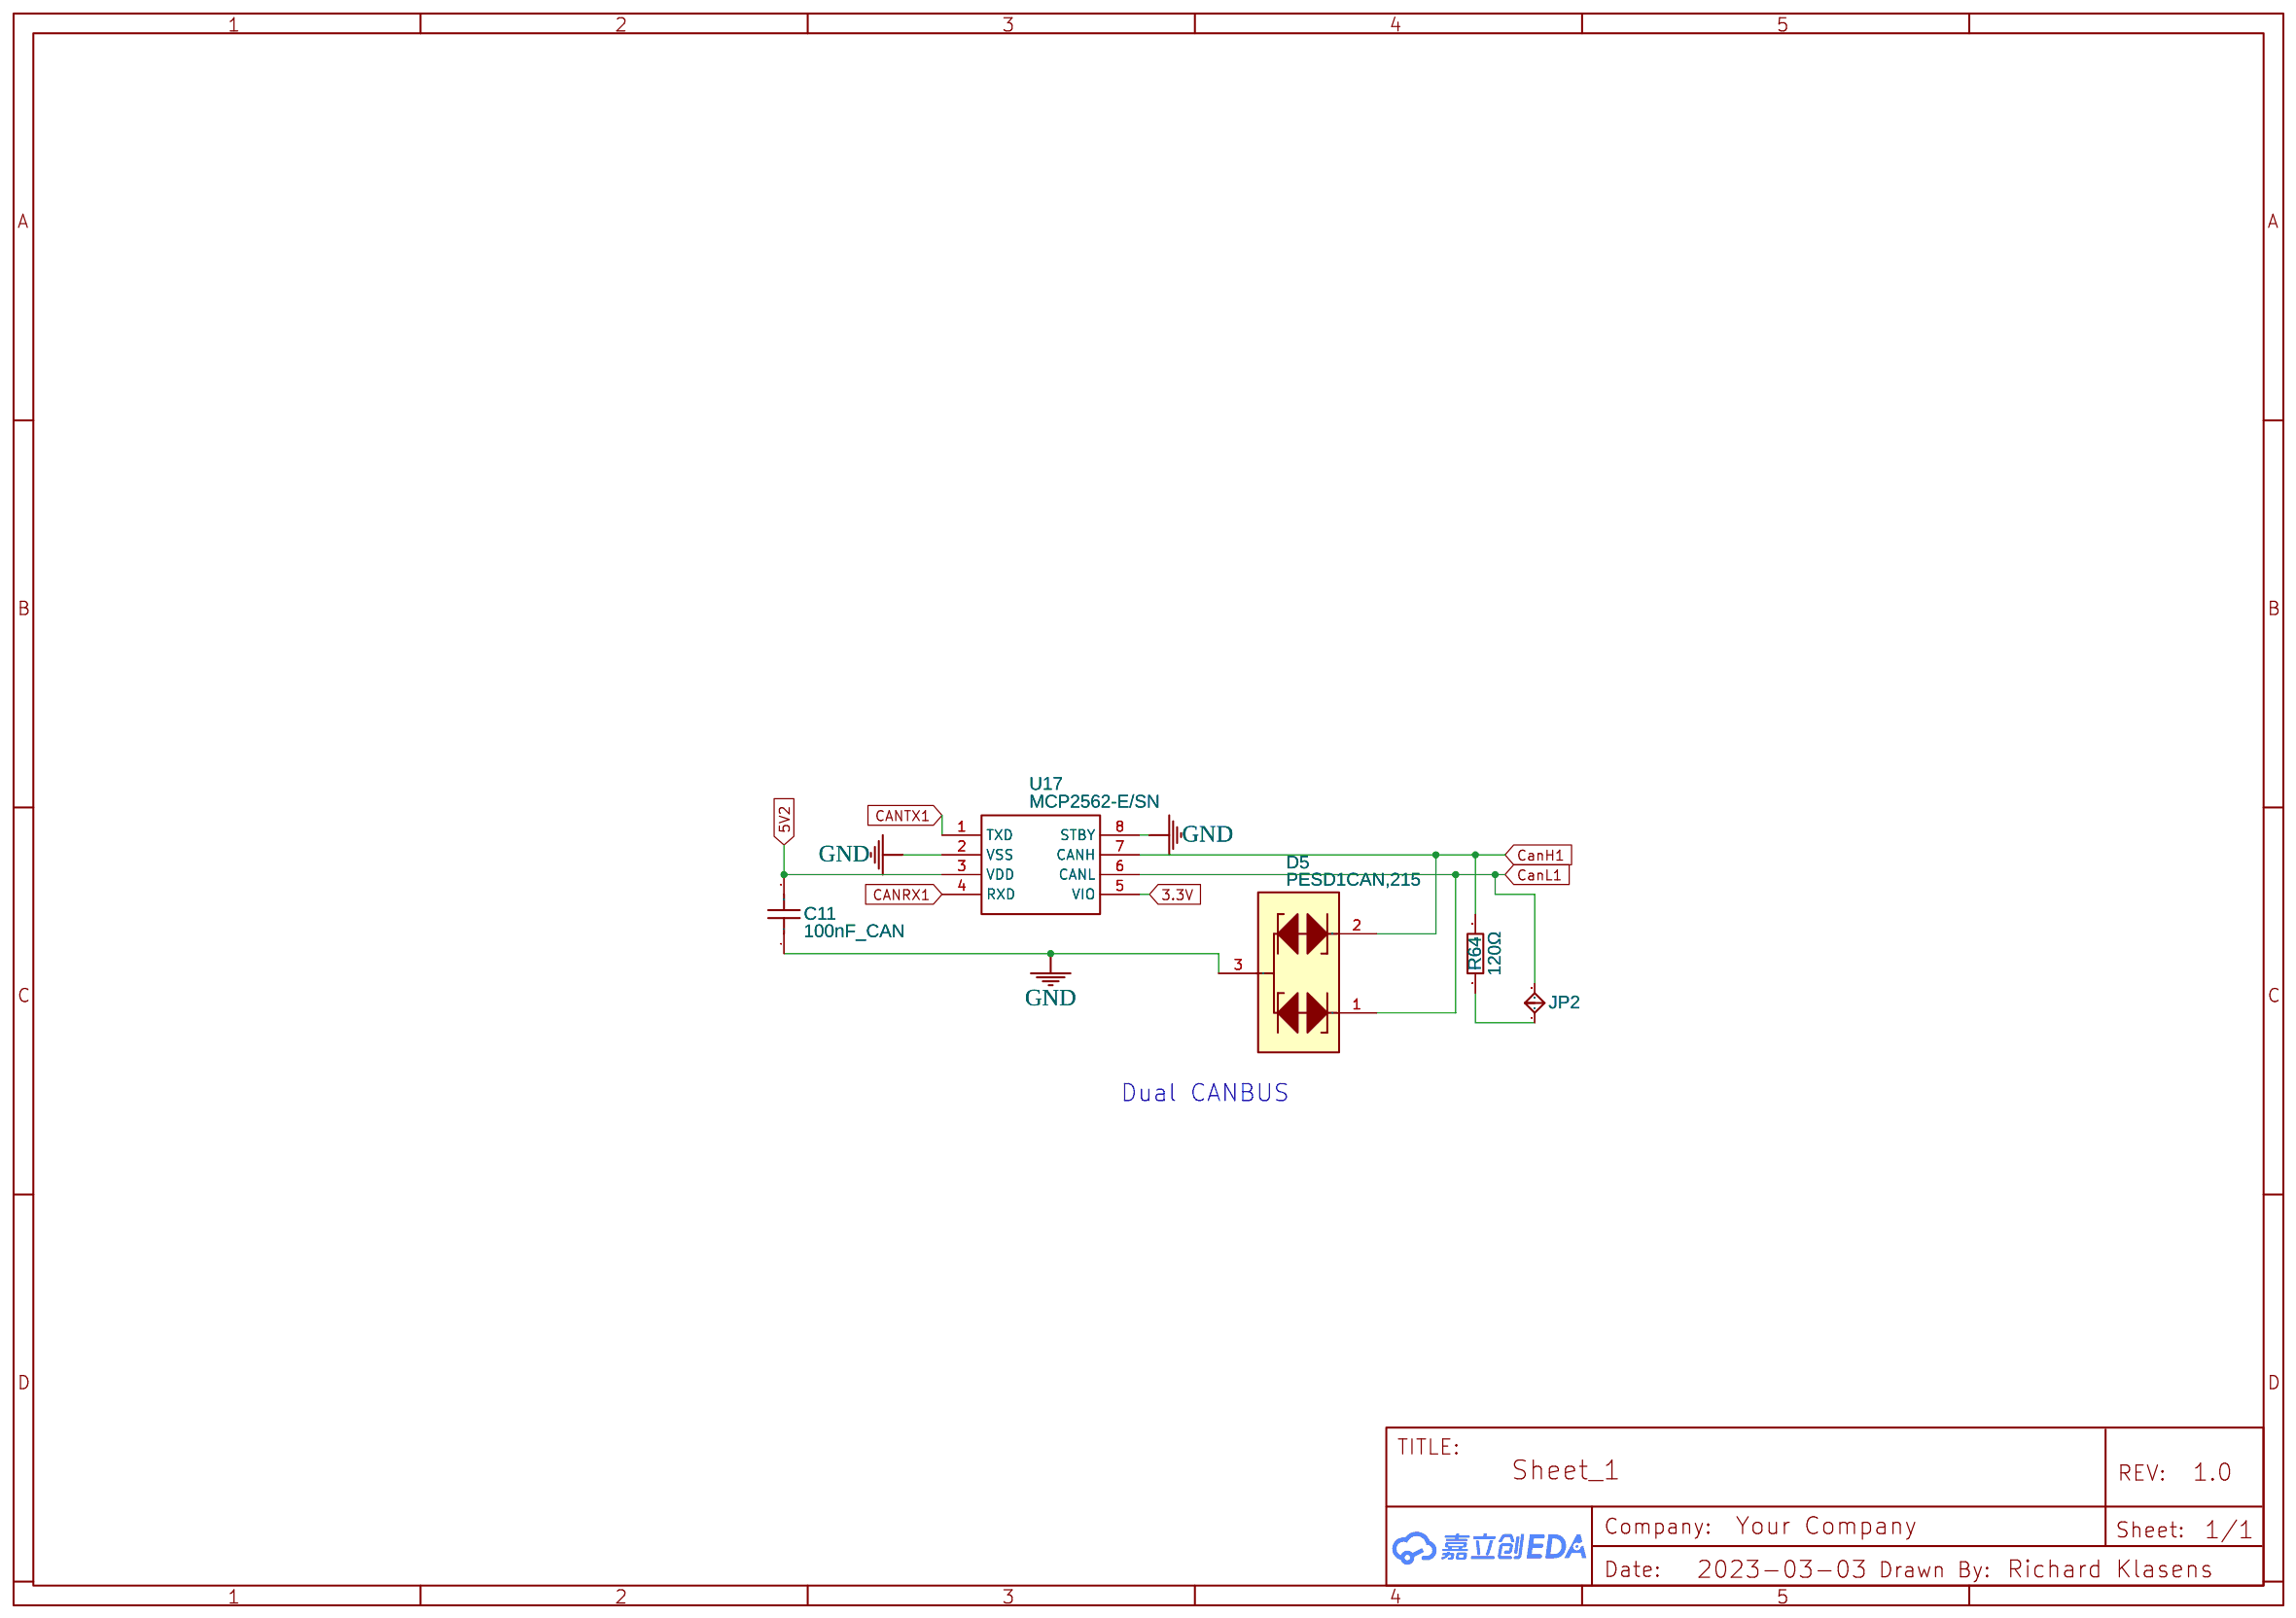
[diagram p7: CANBUS]
9 JUMPERS
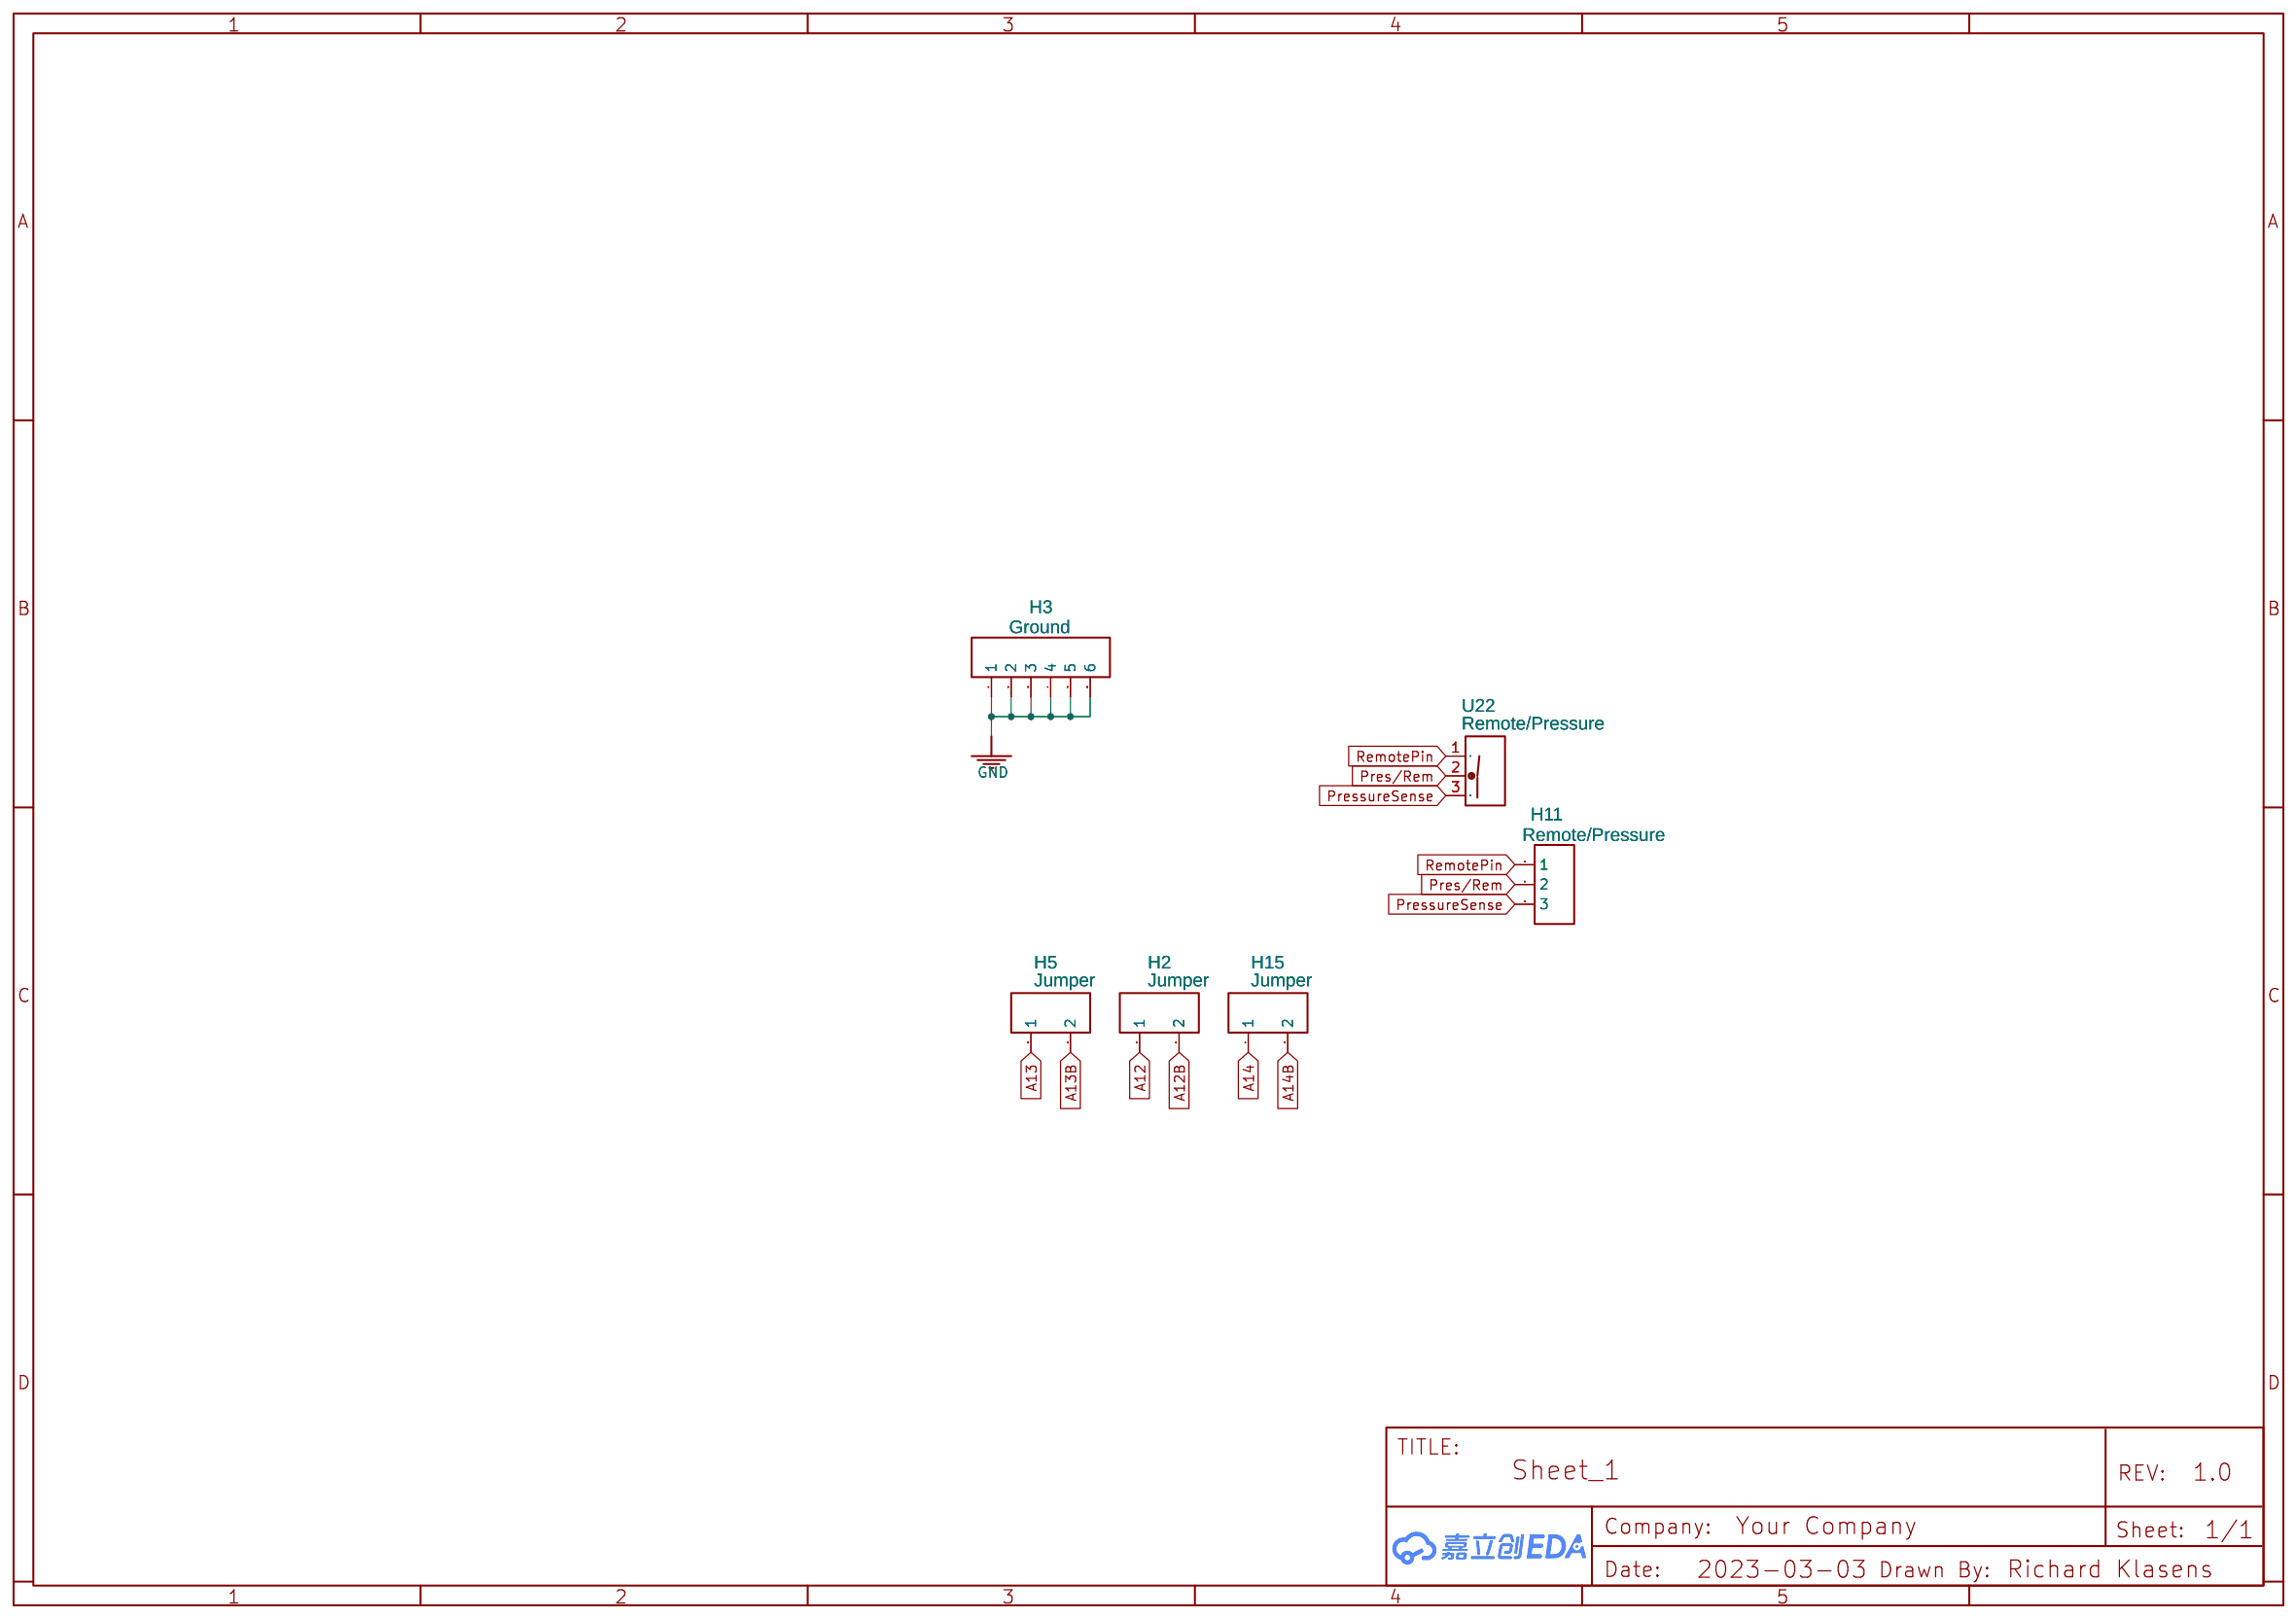
[diagram p8: JUMPERS]
10 SENSORS
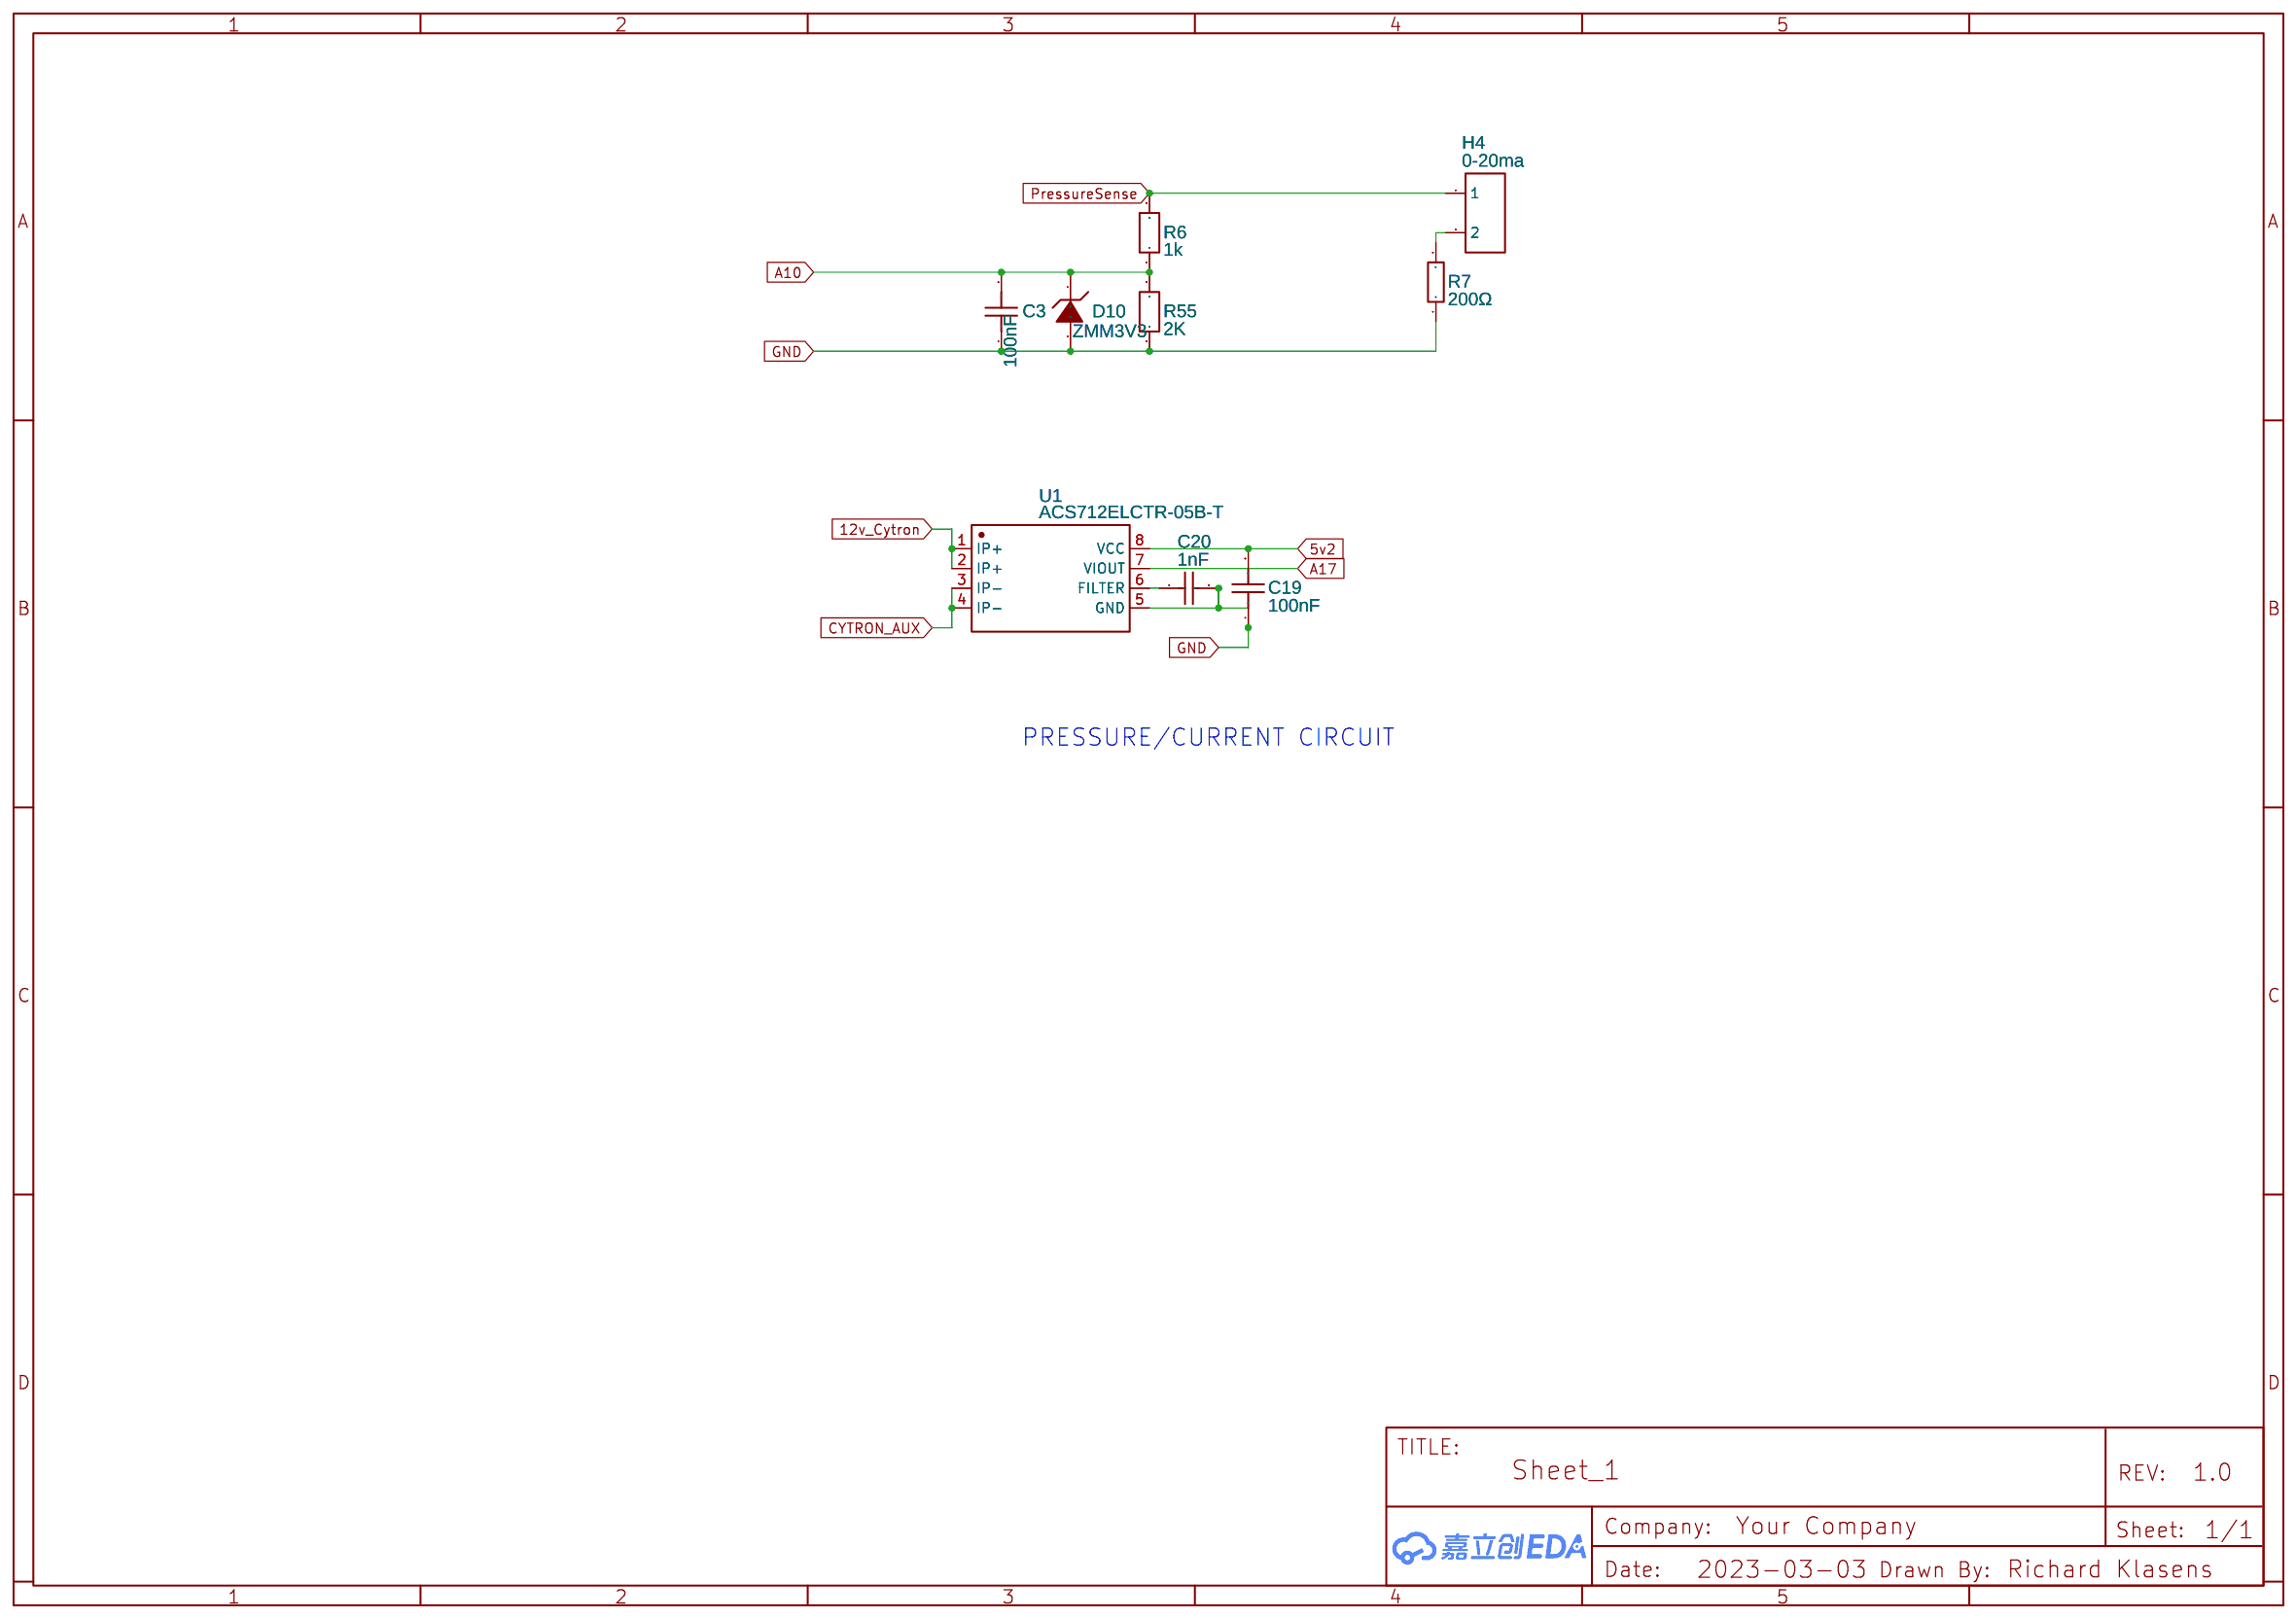
[diagram p9: SENSORS]

## Parts
sheet CANBUS
C11  100nF_CAN  [C0603]
D5  PESD1CAN,215  [SOT-23_L2.9-W1.3-P1.90-LS2.4-BR]
JP2  SPARKFUN-JUMPERS_JUMPER-SMT_2_NC_PASTE_NO-SILK  [SPARKFUN-JUMPERS_SMT-JUMPER_2_NC_PASTE_NO-SILK]
R64  120Ω  [R0805]
U17  MCP2562-E/SN  [SOIC-8_L5.0-W4.0-P1.27-LS6.0-BL]
sheet CONNECTORS
J2  AMPSEAL 23 - 776087-1  [7760871]
K1  DT13-12PA  [DT13-12PA]
sheet GPS
C14  22uF  [CAP-TH_BD4.0-P1.50-D0.8-FD]
H1  RX3-RADIO-F9P  [HDR-TH_3P-P2.54-V-M-1]
H6  HEADER_F9P  [HDR-TH_10P-P2.54-V-F]
H7  HEADER_F9P  [HDR-TH_10P-P2.54-V-F]
H13  HEADER_F9P  [HDR-TH_6P-P2.54-V-F]
H14  HEADER_F9P  [HDR-TH_6P-P2.54-V-F]
LED1  Ant2  [LED-TH_BD5.9-P2.54-RD_GREEN]
LED2  Ant1  [LED-TH_BD5.9-P2.54-RD_GREEN]
LED3  DIFF  [LED-TH_BD5.9-P2.54-RD_GREEN]
P1  RadioPower  [KF2510-3A]
P2  F9P_PVT  [ARDUSIMPLE_F9P]
P3  F9P_RelPosNED  [ARDUSIMPLE_F9P]
P5  HEADER_F9P  [HDR-TH_8P-P2.54-V-F-1]
P6  HEADER_F9P  [HDR-TH_8P-P2.54-V-F-1]
P7  HEADER_F9P  [HDR-TH_8P-P2.54-V-F-1]
P8  HEADER_F9P  [HDR-TH_8P-P2.54-V-F-1]
R8  1k  [RES-TH_BD2.4-L6.3-P10.30-D0.6]
R29  1k  [RES-TH_BD2.4-L6.3-P10.30-D0.6]
R31  1k  [RES-TH_BD2.4-L6.3-P10.30-D0.6]
SJ2  JUMPER-PAD-3-NO  [3_SOLDER_JUMPER_LG]
U900  Bynav_minimal  [BYNAV_C1_MINIMAL]
U901  MP1584EN  [MP1584EN]
sheet IMU
C17  100nF  [C0603]
H18  HEADER_BNO  [HDR-TH_6P-P2.54-V-F]
H19  HEADER_BNO  [HDR-TH_6P-P2.54-V-F]
JP3  SLC  [2_SOLDER_JUMPER_LG]
JP4  RVC Mode  [2_SOLDER_JUMPER_LG]
R12  2.2kΩ  [R0805]
R13  2.2kΩ  [R0805]
SJ1  SDA/RX5  [3_SOLDER_JUMPER_LG]
U15  Ardfruit BNO085  [ADAFRUIT-BNO085]
sheet IO
D1  1N4004_C727080  [SMA_L4.4-W2.8-LS5.4-RD]
D9  1N4004_C727080  [SMA_L4.4-W2.8-LS5.4-RD]
D11  1N4004_C727080  [SMA_L4.4-W2.8-LS5.4-RD]
D14  1N4004_C727080  [SMA_L4.4-W2.8-LS5.4-RD]
D15  1N4004  [DO-41_BD2.4-L4.7-P8.70-D0.9-FD]
LED6  Work_LED  [LED0603-RD]
LED12  SPEED_LED  [LED0603-RD]
LED13  Steer_LED  [LED0603-RD]
LED14  Remote_LED  [LED0603-RD]
Q1  2SC2884 160-320 PY1  [SOT-89-3_L4.5-W2.5-P1.50-LS4.2-BR]
R1  1k  [R0603]
R2  270Ω  [R0603]
R3  270Ω  [R0603]
R5  2K  [R0603]
R14  1k  [R0603]
R15  1k  [R0603]
R16  270Ω  [R0603]
R18  120Ω  [R0805]
R21  1k  [R0603]
R48  200Ω  [R0805]
R65  330  [RES-TH_BD2.4-L6.3-P10.30-D0.6]
R66  200Ω  [R0805]
REMOTEOPTO1  PC817X3NSZ9F  [DIP-4_L4.6-W6.5-P2.54-LS7.6-BL]
STEEROPTO1  PC817X3NSZ9F  [DIP-4_L4.6-W6.5-P2.54-LS7.6-BL]
SW1_SMT  TS-KG02S  [SW-SMD_4P-L6.0-W6.0-P3.90-LS9.5]
SW1_THT  1TS005A-2500-5001  [SW-TH_4P-L6.0-W6.0-P3.90-LS6.5]
SW2_SMT  TS-KG02S  [SW-SMD_4P-L6.0-W6.0-P3.90-LS9.5]
SW2_THT  1TS005A-2500-5001  [SW-TH_4P-L6.0-W6.0-P3.90-LS6.5]
SW3_SMT  TS-KG02S  [SW-SMD_4P-L6.0-W6.0-P3.90-LS9.5]
SW3_THT  1TS005A-2500-5001  [SW-TH_4P-L6.0-W6.0-P3.90-LS6.5]
U26  PC817X3NSZ9F  [DIP-4_L4.6-W6.5-P2.54-LS7.6-BL]
WORKOPTO1  PC817X3NSZ9F  [DIP-4_L4.6-W6.5-P2.54-LS7.6-BL]
sheet JUMPERS
H2  Jumper  [HDR-TH_2P-P2.54-V-M-1]
H3  Ground  [HDR-TH_6P-P2.54-V-M-1]
H5  Jumper  [HDR-TH_2P-P2.54-V-M-1]
H11  Remote/Pressure  [HDR-TH_3P-P2.54-V-M-1]
H15  Jumper  [HDR-TH_2P-P2.54-V-M-1]
U22  Remote/Pressure  [JUMPER3]
sheet MAIN
AS-ACT  DY-339URUYGW/SN  [LED-TH_3P-BD5.0-P2.54]
C1  1000uF  [CAP-TH_BD13.0-P5.00-D1.2-FD]
C15  1000uF  [CAP-TH_BD13.0-P5.00-D1.2-FD]
C21  22uF  [CAP-SMD_BD5.0-L5.3-W5.3-FD]
C22  22uF  [CAP-SMD_BD5.0-L5.3-W5.3-FD]
C23  22uF  [CAP-SMD_BD5.0-L5.3-W5.3-FD]
C26  100nF  [C0603]
CN2  HEADER_ethernet-2X3P  [HDR-TH_6P-P2.00-V-F-R2-C3-S2.00]
D6  S3M  [SMB_L4.6-W3.6-LS5.3-RD]
D7  1N4004  [SMA_L4.4-W2.8-LS5.4-RD]
D13  1N4004  [SMA_L4.4-W2.8-LS5.4-RD]
GPS/RTK  DY-339URUYGW/SN  [LED-TH_3P-BD5.0-P2.54]
LED4  5V_2  [LED0603-RD]
LED5  5V_1  [LED0603-RD]
LED7  5V WAS  [LED0603-RD]
LED18  INVERTED  [LED0805-RD]
PWR/ETH  DY-339URUYGW/SN  [LED-TH_3P-BD5.0-P2.54]
R4  1k  [R0603]
R9  5.1kΩ  [R0603]
R11  5.1kΩ  [R0603]
R17  5.1kΩ  [R0603]
R32  330Ω  [R0603]
R33  330Ω  [R0603]
R34  330Ω  [R0603]
R35  330Ω  [R0603]
R36  330Ω  [R0603]
R37  330Ω  [R0603]
R60  1k  [R0603]
RJ1  HR913550A  [RJ45-TH_HR913550A]
U4  GNSS power  [PWRM-TH_K7805M-1000R3]
U5  Teensy/IMU Power  [PWRM-TH_K7805M-1000R3]
U6  MC7805CTG  [TO-220-3_L10.0-W4.5-P2.54-T]
U7  Header_20pin  [HDR-TH_20P-P2.54-V-F_1.02MM]
U8  Header_20pin  [HDR-TH_20P-P2.54-V-F_1.02MM]
U9  HEADER_TEENSY  [HDR-TH_4P-P2.54-V-F]
U10  HEADER_TEENSY  [HDR-TH_24P-P2.54-V-F]
U11  HEADER_TEENSY  [HDR-TH_24P-P2.54-V-F]
U12  Teensy4.1 ETH only  [TEENSY4.1 ETH ONLY]
U902  HEADER_TEENSYY  [HDR-TH_4P-P2.54-V-F]
sheet SENSORS
C3  100nF  [C0603]
C19  100nF  [C0603]
C20  1nF  [C0603]
D10  ZMM3V3  [LL-34_L3.5-W1.5-RD]
H4  0-20ma  [HDR-TH_2P-P2.54-V-M-1]
R6  1k  [R0603]
R7  200Ω  [R0805]
R55  2K  [R0603]
U1  ACS712ELCTR-05B-T  [SOIC-8_L5.0-W4.0-P1.27-LS6.0-BL]
sheet STEERING
CN1  CYTRON CABLE  [CONN-TH_SEEED-110990030]
D8  S3M  [SMB_L4.6-W3.6-LS5.3-RD]
H8  HEADER_3PIN  [HDR-TH_3P-P2.54-V-F]
H22  Danfoss Us  [HDR-TH_2P-P2.54-V-M-1]
J3  HEADER_Cytron 2x8  [HDR-TH_16P-P2.54-V-F-R2-C8-S2.54-1]
Q3  2SC2884  [SOT-89-3_L4.5-W2.5-P1.50-LS4.2-BR]
Q9  IRF5305PBF  [TO-220-3_L10.0-W4.5-P2.54-T]
R10  1kΩ  [R1206]
R25  1k  [R0603]
R46  1k  [R0603]
R47  10kΩ  [R1206]
R49  1k  [R0603]
R50  1k  [R0603]
U2  Cytron MD13S  [CYTRON MD13S]
U3  TC4427AEOA713  [SOIC-8_L4.9-W3.9-P1.27-LS6.0-BL]
U13  HEAT_SINK  [SINK-TH_L15.0-W10.5-H21.0]
sheet WAS
C16  100nF  [C0603]
C30  10nF  [C0805]
C31  10nF  [C0805]
H9  HEADER_ADS-MCP6002  [HDR-F-2.54_1X10]
H10  22850102ANG1SYA02  [HDR-TH_2P-P2.54-V-F]
JP1  A0  [2_SOLDER_JUMPER_LG]
P4  ADS1115  [ADS1115 BREAKOUT BOARD]
Q4  2N7002  [SOT-23-3_L2.9-W1.3-P1.90-LS2.4-BR]
Q5  2N7002  [SOT-23-3_L2.9-W1.3-P1.90-LS2.4-BR]
R22  5.1kΩ  [R0603]
R53  1.5kΩ  [R0603]
R56  1.5kΩ  [R0603]
R63  5.1kΩ  [R0603]
U20  ADS1115IDGSR  [MSOP-10_L3.0-W3.0-P0.50-LS5.0-BL]

## Library data of the parts
C3 C11 C16 C17 C19 C26 = CC0603KRX7R9BB104: Supplier: LCSC; Manufacturer: YAGEO; Supplier Part: C14663; JLCPCB Part Class: Basic Part
D5 = PESD1CAN,215: Supplier: LCSC; Manufacturer: Nexperia; image: //image.lceda.cn/szlcsc/C15771.jpg; Supplier Part: C15771; SMT Type: Extend; JLCPCB SMD: Yes; Paste Type: expand
JP2 = SPARKFUN-JUMPERS_JUMPER-SMT_2_NC_PASTE_NO-SILK: Contributor: raskol; Supplier: opencircuit
R18 R64 = 0805W8F1200T5E: Supplier: LCSC; Manufacturer: UniOhm; Supplier Part: C17437; Resistance (Ohms): 120; JLCPCB Part Class: Basic Part
U17 = MCP2562-E/SN: Supplier: LCSC; Manufacturer: MICROCHIP; Supplier Part: C53609; JLCPCB Part Class: Extended Part
J2 = AMPSEAL 23 - 776087-1: Contributor: aKKoufen; Link: https://fr.rs-online.com/web/p/embases-circuits-imprimes/7181471; Code RS: 718-1471; Ref Fabricant: 776087-1; Marque: TE Connectivity; Supplier Part: C378893
K1 = DT13-12PA: Manufacturer: DEUTSCH DT; link: https://www.te.com/usa-en/product-DT13-12PA.html?fbclid=IwAR39tNBAoYJf2IA76Wg8xnUmEBiRwHUhbK_2fx16O6vP97envFwLxjVRyOc; Contributor: razzer_n
C14 = 22uF 16V 4*7: Supplier: LCSC; Manufacturer: ValuePro; Supplier Part: C43845; JLCPCB Part Class: Extended Part
H1 H11 = Header-Male-2.54_1x3: Supplier: LCSC; Manufacturer: BOOMELE; Manufacturer Part: Header2.54mm 1*3P; Supplier Part: C49257; JLCPCB Part Class: Extended Part
H6 H7 = PM254-1-10-Z-8.5: Supplier: LCSC; Supplier Part: C2897373; Manufacturer: HCTL(华灿天禄); Contributor: LCSC; JLCPCB Part Class: Extended Part
H13 H14 H18 H19 = PM254-1-06-Z-8.5: Supplier: LCSC; Supplier Part: C2897369; Manufacturer: HCTL(华灿天禄); Contributor: LCSC; JLCPCB Part Class: Extended Part
LED1-LED3 = LTL-307G: Supplier: LCSC; Supplier Part: C125080; Manufacturer: Lite-On; Contributor: LCSC; JLCPCB Part Class: Extended Part
P1 = KF2510-3A: Supplier Part: E29275; Supplier: EasyEDA
P2 P3 = UNO_R3: sourceId: 1T5FDZYC8
P5-P8 = Header-Female-2.54_1x8: Supplier: LCSC; Manufacturer: BOOMELE(博穆精密); Manufacturer Part: 2.54-1*8P母环保; Supplier Part: C27438; JLCPCB Part Class: Extended Part
R8 R29 R31 = RD 1/2WS 1K J T/B A1: Supplier: LCSC; Supplier Part: C433798; Manufacturer: TyoHM; Contributor: LCSC
SJ1 SJ2 = JUMPER-PAD-3-NO: Contributor: Matt Elias
U900 = Bynav_minimal: Contributor: GoRoNb
U901 = MP1584EN: Contributor: babeinlovexd
JP1 JP3 JP4 = (JONGJIN)JUMPER_PAD_2P: Jumper 2 Pin; Contributor: PatternAgents
R12 R13 = 0805W8F2201T5E: Supplier: LCSC; Manufacturer: UniOhm; Supplier Part: C17520; Resistance (Ohms): 2.2K; JLCPCB Part Class: Basic Part
U15 = Ardfruit BNO085: Manufacturer: Ardfruit; Contributor: THume
D1 D9 D11 D14 = 1N4004_C727080: Supplier: LCSC; Supplier Part: C727080; Manufacturer: TWGMC; Manufacturer Part: 1N4004; Contributor: LCSC; JLCPCB Part Class: Extended Part
D15 = 1N4004: Supplier: LCSC; Manufacturer: MDD; image: //image.lceda.cn/szlcsc/C3058.jpg; Supplier Part: C3058; LCSC Assembly: Yes; SMT Type: Extend
LED6 LED13 LED14 = 19-217/BHC-ZL1M2RY/3T: Supplier: LCSC; Manufacturer: EVERLIGHT(亿光); Supplier Part: C72041; JLCPCB Part Class: Basic Part
LED12 = 19-213/Y2C-CQ2R2L/3T(CY): Supplier: LCSC; Manufacturer: EVERLIGHT(亿光); Supplier Part: C72038; JLCPCB Part Class: Basic Part
Q1 Q3 = 2SC2884 160-320 PY1: Supplier: LCSC; Manufacturer: CJ; Supplier Part: C24205; JLCPCB Part Class: Extended Part
R1 R4 R6 R14 R15 R21 R25 R46 R49 R50 R60 = R_0603_EU: Supplier Part: C269704; Supplier: LCSC; Contributor: LCEDA_Lib; Manufacturer Part: RMC06031K1%N; Resistance (Ohms): 1K; Manufacturer: Tyohm(幸亚电阻)
R2 R3 R16 = 0603WAF2700T5E: Supplier: LCSC; Manufacturer: UNI-ROYAL(厚声); Supplier Part: C22966; Resistance (Ohms): 270; JLCPCB Part Class: Basic Part
R5 R55 = R_0603_EU: Supplier Part: C105581; Supplier: LCSC; Contributor: LCEDA_Lib; Manufacturer Part: RC0603JR-072KL; Manufacturer: YAGEO(国巨)
R7 R48 R66 = 0805W8F2000T5E: Supplier: LCSC; Manufacturer: UNI-ROYAL(厚声); Supplier Part: C17540; Resistance (Ohms): 200; JLCPCB Part Class: Basic Part
R65 = RD 1/2WS 1K J T/B A1: Supplier: LCSC; Manufacturer: TyoHM; Contributor: LCSC
REMOTEOPTO1 STEEROPTO1 U26 WORKOPTO1 = PC817X3NSZ9F: Supplier: LCSC; Manufacturer: SHARP(夏普); Supplier Part: C96006; JLCPCB Part Class: Extended Part
SW1_SMT SW2_SMT SW3_SMT = TS-KG02S: Supplier: LCSC; Supplier Part: C410366; Manufacturer: HANBO(汉博); Contributor: LCSC; JLCPCB Part Class: Extended Part
SW1_THT SW2_THT SW3_THT = 1TS005A-2500-5001: Supplier: LCSC; Supplier Part: C255811; Manufacturer: HYP(鸿源精密); Contributor: LCSC; JLCPCB Part Class: Extended Part
H2 H4 H5 H15 = Header-Male-2.54_1x2: Supplier: LCSC; Supplier Part: C2905434; JLCPCB Part Class: Extended Part
H3 = Header-Male-2.54_1x6: Supplier: LCSC; Manufacturer: BOOMELE; Supplier Part: C37208; JLCPCB Part Class: Extended Part
U22 = JUMPER3: Contributor: jeen
AS-ACT GPS/RTK PWR/ETH = DY-339URUYGW/SN: Supplier: LCSC; Supplier Part: C459134; Manufacturer: TONYU; Contributor: LCSC; JLCPCB Part Class: Extended Part
C1 C15 = 35YXJ1000M12.5X20: Supplier: LCSC; Manufacturer: rubycon(红宝石); Supplier Part: C88743; JLCPCB Part Class: Extended Part
C21-C23 = VT1V220M0505: Supplier: LCSC; Supplier Part: C239256; Manufacturer: ROQANG; Contributor: LCSC; JLCPCB Part Class: Extended Part
CN2 = A2005HWV-2X3P: Supplier: LCSC; Supplier Part: C225302; Manufacturer: Changjiang Connectors; Manufacturer Part: A2005HWV-2x3P; Contributor: LCSC; JLCPCB Part Class: Extended Part
D6 D8 = S3M: Supplier: LCSC; Manufacturer: MDD; Supplier Part: C47524; JLCPCB Part Class: Extended Part
D7 D13 = 1N4004_C727080: Supplier: LCSC; Supplier Part: C727080; Manufacturer: TWGMC; Contributor: LCSC; JLCPCB Part Class: Extended Part
LED4 LED5 LED7 = 19-217/GHC-YR1S2/3T: Supplier: LCSC; Manufacturer: EVERLIGHT(亿光); Supplier Part: C72043; JLCPCB Part Class: Basic Part
LED18 = FC-2012HRK-620D: Supplier: LCSC; Manufacturer: 国星光电; Manufacturer Part: NCD0805R1; Supplier Part: C84256; JLCPCB Part Class: Basic Part
R9 R11 R17 R22 R63 = 0603WAF5101T5E: Supplier: LCSC; Manufacturer: UniOhm; Supplier Part: C23186; Resistance (Ohms): 5.1K; JLCPCB Part Class: Basic Part
R32-R37 = 0603WAF3300T5E: Supplier: LCSC; Manufacturer: UniOhm; Supplier Part: C23138; Resistance (Ohms): 330; JLCPCB Part Class: Basic Part
RJ1 = HR913550A: Supplier: LCSC; Manufacturer: HANRUN; Contributor: LCSC; Supplier Part: C163507; JLCPCB Part Class: Extended Part
U4 U5 = K7805M-1000R3: Supplier: LCSC; Manufacturer: MORNSUN; Contributor: LCSC; Supplier Part: C132362; JLCPCB Part Class: Extended Part
U6 = MC7805CTG: Supplier: LCSC; Manufacturer: ON; Supplier Part: C22456; JLCPCB Part Class: Extended Part; Package Display: No
U7 U8 = Header-Female-2.54_1x20: Supplier: LCSC; Manufacturer: BOOMELE; Manufacturer Part: 2.54mm 1*20P Female header; Supplier Part: C50984; JLCPCB Part Class: Extended Part
U9 U902 = FH-00133: Supplier: LCSC; Supplier Part: C2685089; Manufacturer: Liansheng(连盛); Contributor: LCSC; JLCPCB Part Class: Extended Part
U10 U11 = X6511FV-24-C85D32: Supplier: LCSC; Supplier Part: C2883741; Manufacturer: XKB Connectivity(中国星坤); Contributor: LCSC; JLCPCB Part Class: Extended Part
U12 = Teensy4.1 ETH only: Manufacturer: PJRC; Manufacturer Part: Teensy4.1; link: https://www.pjrc.com/store/teensy41.html; Contributor: Synchrotron
C20 = CL10B102KB8NNNC: Supplier: LCSC; Manufacturer: SAMSUNG; Supplier Part: C1588; JLCPCB Part Class: Basic Part
D10 = ZMM3V3: Supplier: LCSC; Manufacturer Part: ZMM3V3-M; Manufacturer: ST(先科); Supplier Part: C8056; JLCPCB Part Class: Basic Part
U1 = ACS712ELCTR-05B-T: Supplier: LCSC; Manufacturer: ALLEGRO; Supplier Part: C44471; JLCPCB Part Class: Extended Part
CN1 = SEEED-110990030: Supplier: LCSC; Supplier Part: C403774; Manufacturer: Seeed(矽递科技); Contributor: LCSC; JLCPCB Part Class: Extended Part
H8 = FFH25405-S03S1001K6K: Supplier: LCSC; Supplier Part: C146243; Contributor: LCSC; JLCPCB Part Class: Extended Part
H22 = 68000-102HLF: Supplier: LCSC; Supplier Part: C2905434; Contributor: LCSC; JLCPCB Part Class: Extended Part
J3 = Header-Female-2.54_2x8: Supplier: LCSC; Manufacturer: BOOMELE(博穆精密); Manufacturer Part: 2.54-2*8P母; Supplier Part: C30734; JLCPCB Part Class: Extended Part
Q9 = IRF5305PBF: Supplier: LCSC; Manufacturer: Infineon(英飞凌); Supplier Part: C2623; JLCPCB Part Class: Extended Part
R10 = 1206W4F1001T5E: Supplier: LCSC; Manufacturer: UniOhm; Supplier Part: C4410; Resistance (Ohms): 1K; JLCPCB Part Class: Basic Part
R47 = 1206W4F1002T5E: Supplier: LCSC; Manufacturer: UniOhm; Supplier Part: C17902; Resistance (Ohms): 10K; JLCPCB Part Class: Basic Part
U2 = Cytron MD13S: Contributor: THume
U3 = TC4427AEOA713: Supplier: LCSC; Manufacturer: MICROCHIP(美国微芯); Contributor: LCSC; Supplier Part: C20551; JLCPCB Part Class: Extended Part
U13 = 15*10.5*21: Supplier: LCSC; Supplier Part: C4649; Manufacturer: Made in China; Contributor: LCSC; JLCPCB Part Class: Extended Part
C30 C31 = CL21B103KBANNNC: Supplier: LCSC; Manufacturer: SAMSUNG; Supplier Part: C1710; JLCPCB Part Class: Basic Part
H9 = HDR-F-2.54_1x10: Supplier Part: C2897373; Supplier: LCSC; Contributor: LCEDA_Lib
H10 = 22850102ANG1SYA02: Supplier: LCSC; Supplier Part: C429966; Manufacturer: JILN(锦凌); Contributor: LCSC; JLCPCB Part Class: Extended Part
P4 = ADS1115: sourceId: 1T5FDZYC8; Package Display: No
Q4 Q5 = 2N7002: Supplier: LCSC; Manufacturer: CJ; Supplier Part: C8545; JLCPCB Part Class: Basic Part
R53 R56 = 0603WAF1501T5E: Supplier: LCSC; Manufacturer: UniOhm; Supplier Part: C22843; Resistance (Ohms): 1.5K; JLCPCB Part Class: Basic Part
U20 = ADS1115IDGSR: Supplier: LCSC; Manufacturer: TI; Supplier Part: C37593; JLCPCB Part Class: Extended Part

## Nets
3.3V: C17.2 H10.1 H19.1 JP4.1 P2.26(IOREF) P3.26(IOREF) P6.7 P7.7 Q4.1(G) Q5.1(G) R1.1 R4.1 R12.1 R13.1 R14.1 R15.1 U7.15 U11.15 U12.15(3V3) U15.1(Vin) U17.5(VIO)
5V1: C23.1 P1.1 P2.29(5V) P3.29(5V) P6.4 P7.4 R9.2 U4.3(+VO) U901.1(VIN)
5V2: C11.2 C22.1 R2.2 R3.2 R5.1 R16.2 R17.2 R48.1 U5.3(+VO) U8.1 U10.1 U12.48(VIN) U17.3(VDD)
5v2: C19.2 U1.8(VCC)
5v_WAS: C16.1 C21.1 H9.1 J2.1 K1.1 LED7.2(A) P4.1(VDD) R22.1 R63.1 U6.3(Output) U20.8(VDD)
12v_Cytron: J3.1 J3.2 J3.3 J3.4 U1.1(IP+) U1.2(IP+) U2.4(+12/24)
+3V3_Bynav: C14.1 U900.6(VCC_3V3) U901.3(VOUT)
+12v_board: C1.1 C15.1 D6.1(K) D7.1(K) J2.20 K1.7 Q9.3(S) R47.2 U4.1(VIN) U5.1(VIN) U6.1(Input)
+12v_in: D6.2(A) D13.1(K) J2.22 K1.11
GND: AS-ACT.2(-) C1.2 C3.1 C11.1 C15.2 C16.2 C17.1 C19.1 C20.2 C21.2 C22.2 C23.2 C26.1 C30.1 C31.2 CN1.4 CN2.4 D5.3 D7.2(A) D8.2(A) D10.2(A) GPS/RTK.2(-) H3.1 H3.2 H3.3 H3.4 H3.5 H3.6 H6.7 H7.7 H8.3 H9.2 H19.3 J2.4 J2.21 J2.23 J3.5 J3.6 J3.7 J3.8 K1.3 K1.10 K1.12 LED1.1(-) LED2.1(-) LED3.1(-) LED4.1(C) LED5.1(C) LED18.2(+) P2.7(GND) P3.7(GND) P4.2(GND) PWR/ETH.2(-) Q1.3(E) Q3.3(E) R7.1 R11.1 R55.1 REMOTEOPTO1.3 RJ1.8(GND) RJ1.10 RJ1.11 RJ1.13 RJ1.14 STEEROPTO1.3 SW1_SMT.3 SW1_SMT.4 SW1_THT.3 SW1_THT.4 SW2_SMT.3 SW2_SMT.4 SW2_THT.3 SW2_THT.4 SW3_SMT.3 SW3_SMT.4 SW3_THT.3 SW3_THT.4 U1.5(GND) U2.3(GND) U2.5(GND) U3.3(GND) U4.2(GND) U5.2(GND) U6.2(Ground) U7.1 U8.2 U8.15 U10.2 U10.15 U11.1 U12.1(GND) U12.34(GND) U12.47(GND) U12.64(GND) U15.3(GND) U17.2(VSS) U17.8(STBY) U20.3(GND) U900.17(GND) U901.2(GND) WORKOPTO1.3
Gnd: P1.2 P2.30(GND) P2.31(GND) P3.30(GND) P3.31(GND) P6.2 P6.3 P7.2 P7.3
A0: JP1.2 U8.13 U10.13 U12.36(14_PWM_A0_TX3_SPDIF>)
A7-RX5: SJ1.1 U8.6 U10.6 U12.43(21_A7_RX5_BCLK1)
A10: C3.2 D10.1(C) R6.1 R55.2 U7.16 U11.16 U12.16(24_PWM_A10_TX6_SCL2)
A12: H2.1 U7.18 U11.18 U12.18(26_A12_MOSI1)
A12B: H2.2 J2.11
A13: H5.1 U7.19 U11.19 U12.19(27_A13_SCK1)
A13B: H5.2 J2.12
A14: H15.1 U8.19 U10.19 U12.30(38_DAT3)
A14B: H15.2 J2.13
A15: U8.18 U10.18 U12.31(39_DAT2)
A16: U8.17 U10.17 U12.32(40_A16_CS1)
A17: U1.7(VIOUT) U8.16 U10.16 U12.33(41_A17_MIS01)
AS_ACT: R34.2 U7.14 U11.14 U12.14(12_PWM_MISO_MQSL)
AS_STB: R35.2 U7.13 U11.13 U12.13(11_PWM_MOSI_CTX1)
BNO-SDA: H19.5 R13.2 SJ1.2 SJ1.3 U8.9 U10.9 U12.40(18_PWM_A4_SDA0) U15.5(SDA)
CanH1: D5.2 J2.16 R64.2 U17.7(CANH)
CanL1: D5.1 J2.17 JP2.2 U17.6(CANL)
CANRX1: U11.22 U12.22(30_CRX3) U17.4(RXD) U902.2
CANTX1: U11.23 U12.23(31_CTX3) U17.1(TXD) U902.3
CYTRON_AUX: J2.18 U1.3(IP-) U1.4(IP-)
DIR: R49.1 U7.6 U11.6 U12.6(4_PWM_BCLK2)
ETHERNET: R36.2 U7.8 U11.8 U12.8(6_PWM_OUT1D)
FREEWHEELMOD: CN1.3 R46.2
GPSFIX: R33.2 U7.11 U11.11 U12.11(9_PWM_OUT1C)
LEFT: H22.2 J2.5 J3.9 J3.10 J3.11 J3.12 K1.5 U2.6(MA)
LOCK: D8.1(K) J2.7 K1.6 Q9.2(D) U3.6(VDD)
POWERON: R37.2 U7.7 U11.7 U12.7(5_PWM_IN2)
Pres/Rem: H11.2 J2.10 K1.8 U22.2
PressureSense: H4.1 H11.3 R6.2 U22.3
PWM1: R50.1 U3.2(IN A) U7.4 U11.4 U12.4(2_PWM_OUT2)
PWM2: R25.1 R46.1 U7.5 U11.5 U12.5(3_PWM_LRCLK2)
RemotePin: D9.1(K) H11.1 U22.1
RemoteSw: LED14.1(C) REMOTEOPTO1.4 U8.20 U10.20 U12.29(37_PWM_CMD_SCK2)
RIGHT: J2.6 J3.13 J3.14 J3.15 J3.16 K1.4 U2.7(MB)
RTKFIX: R32.2 U7.12 U11.12 U12.12(10_PWM_CS_MQSR)
RX1: P2.11(D0) P5.1 U7.20 U11.20 U12.20(28_PWM_RX7) U900.16(RxD1)
RX2: P3.11(D0) P8.1 U7.9 U11.9 U12.9(7_PWM_RX2_OUT1A)
RX3: H1.2 H1.3 P1.3 SJ2.1 SJ2.2 U8.12 U10.12 U12.37(15_PWM_A1_RX3_SPDIF<)
SCL0: H19.4 JP3.1 JP3.2 R12.2 U8.8 U10.8 U12.41(19_PWM_A5_SCL0) U15.4(SCL)
SCL_HV: H9.3 P4.3(SCL) Q4.3(D) R63.2 U20.10(SCL)
SCL_LV: Q4.2(S) U8.11 U10.11 U12.38(16_A2_RX4_SCL1)
SDA_HV: H9.4 P4.4(SDA) Q5.3(D) R22.2 U20.9(SDA)
SDA_LV: Q5.2(S) U8.10 U10.10 U12.39(17_A3_TX4_SDA1)
SPEED+: J2.14 R65.2 R66.1
SPEED-: D14.1(K) D15.2(K) J2.15
Speedpulse: R21.1 U9.1 U10.21 U12.28(36_PWM_CLK_CS2)
SteerPin: D1.1(K) J2.8 K1.9
SteerSw: LED13.1(C) STEEROPTO1.4 U11.24 U12.24(32_OUT1B) U902.4
TX1: P2.12(D1) P5.2 U11.21 U12.21(29_PWM_TX7) U900.15(TxD1) U902.1
TX2: P3.12(D1) P8.2 U7.10 U11.10 U12.10(8_PWM_TX2_IN1)
TX2_F9p: H1.1 P2.13(D2) P5.3 SJ2.3
WAS_H: C30.2 J2.2 K1.2 R53.2
WAS_H_2: H9.7 P4.7(A0) R53.1 U20.4(AIN0)
WAS_L: C31.1 J2.3 R56.2
WAS_L_2: H9.8 P4.8(A1) R56.1 U20.5(AIN1)
WorkPin: D11.1(K) J2.9
WorkSw: U9.3 U10.23 U12.26(34_DAT1_MISO2)
WorkSW: LED6.1(C) WORKOPTO1.4
Net-(AS-ACT-1): AS-ACT.1(+) R34.1
Net-(AS-ACT-3): AS-ACT.3(+) R35.1
Net-(C14-2): C14.2 U900.14(GND) U900.20(GND) U900.22(GND) U901.4(GND)
Net-(C20-1): C20.1 U1.6(FILTER)
Net-(C26-2): C26.2 RJ1.4 RJ1.5
Net-(CN1-1): CN1.1 H8.1 R49.2 U2.1(DIR)
Net-(CN1-2): CN1.2 H8.2 R50.2 U2.2(PWM)
Net-(CN2-1): CN2.1 RJ1.3 U12.60(R+)
Net-(CN2-2): CN2.2 RJ1.6 U12.65(R-)
Net-(CN2-3): CN2.3 RJ1.12 U12.61(LED)
Net-(CN2-5): CN2.5 RJ1.2 U12.62(T-)
Net-(CN2-6): CN2.6 RJ1.1 U12.63(T+)
Net-(D1-2): D1.2(A) STEEROPTO1.2 SW1_SMT.1 SW1_SMT.2 SW1_THT.1 SW1_THT.2
Net-(D9-2): D9.2(A) REMOTEOPTO1.2 SW2_SMT.1 SW2_SMT.2 SW3_THT.1 SW3_THT.2
Net-(D11-2): D11.2(A) SW2_THT.1 SW2_THT.2 SW3_SMT.1 SW3_SMT.2 WORKOPTO1.2
Net-(D13-2): D13.2(A) R60.1
Net-(D14-2): D14.2(A) D15.1(A) U26.3
Net-(GPS/RTK-1): GPS/RTK.1(+) R32.1
Net-(GPS/RTK-3): GPS/RTK.3(+) R33.1
Net-(H4-2): H4.2 R7.2
Net-(H6-1): H6.1 P2.1(D8) P3.13(D2) P8.3
Net-(H9-5): H9.5 P4.5(ADDR)
Net-(H9-6): H9.6 P4.6(ALRT)
Net-(H9-9): H9.9 P4.9(A2)
Net-(H9-10): H9.10 P4.10(A3)
Net-(H10-2): H10.2 JP1.1
Net-(H13-1): H13.1 P2.24(A5)
Net-(H13-2): H13.2 P2.23(A4)
Net-(H13-3): H13.3 P2.22(A3)
Net-(H13-4): H13.4 P2.21(A2)
Net-(H13-5): H13.5 P2.20(A1)
Net-(H13-6): H13.6 P2.19(A0)
Net-(H14-1): H14.1 P3.24(A5)
Net-(H14-2): H14.2 P3.23(A4)
Net-(H14-3): H14.3 P3.22(A3)
Net-(H14-4): H14.4 P3.21(A2)
Net-(H14-5): H14.5 P3.20(A1)
Net-(H14-6): H14.6 P3.19(A0)
Net-(H18-1): H18.1 U15.7(CS)
Net-(H18-2): H18.2 U15.8(DI)
Net-(H18-3): H18.3 U15.9(RST)
Net-(H18-4): H18.4 U15.10(P1)
Net-(H18-5): H18.5 JP4.2 U15.11(P0)
Net-(H18-6): H18.6 U15.12(BT)
Net-(H19-2): H19.2 U15.2(3v3)
Net-(H19-6): H19.6 U15.6(INT)
Net-(H22-1): H22.1 R10.2
Net-(JP2-1): JP2.1 R64.1
Net-(LED1-2): LED1.2(+) R8.1
Net-(LED2-2): LED2.2(+) R29.1
Net-(LED3-2): LED3.2(+) R31.1
Net-(LED4-2): LED4.2(A) R17.1
Net-(LED5-2): LED5.2(A) R9.1
Net-(LED6-2): LED6.2(A) R14.2
Net-(LED7-1): LED7.1(C) R11.2
Net-(LED12-1): LED12.1(C) Q1.2(C) U26.2
Net-(LED12-2): LED12.2(A) R5.2
Net-(LED13-2): LED13.2(A) R15.2
Net-(LED14-2): LED14.2(A) R1.2
Net-(LED18-1): LED18.1(-) R60.2
Net-(P2-14): P2.14(D3) P5.4
Net-(P2-15): P2.15(D4) P5.5
Net-(P2-16): P2.16(D5) P5.6
Net-(P2-17): P2.17(D6) P5.7
Net-(P2-18): P2.18(D7) P5.8
Net-(PWR/ETH-1): PWR/ETH.1(+) R36.1
Net-(PWR/ETH-3): PWR/ETH.3(+) R37.1
Net-(Q1-1): Q1.1(B) R21.2
Net-(Q3-1): Q3.1(B) R25.2
Net-(Q3-2): Q3.2(C) Q9.1(G) R47.1
Net-(R2-1): R2.1 STEEROPTO1.1
Net-(R3-1): R3.1 REMOTEOPTO1.1
Net-(R4-2): R4.2 RJ1.9
Net-(R8-2): R8.2 U900.10(Ant2/CANRX//)
Net-(R10-1): R10.1 U3.7(OUT A#)
Net-(R16-1): R16.1 WORKOPTO1.1
Net-(R18-1): R18.1 R66.2
Net-(R18-2): R18.2 R65.1 U26.4
Net-(R29-2): R29.2 U900.7(Ant1//)
Net-(R31-2): R31.2 U900.21(SCLK//)
Net-(R48-2): R48.2 U26.1
Net-(U7-2): U7.2 U11.2 U12.2(0_PWM_RX1_CRX2_CS1)
Net-(U7-3): U7.3 U11.3 U12.3(1_PWM_TX1_CTX2_MISO1)
Net-(U7-17): U7.17 U11.17 U12.17(25_PWM_A11_RX6_SDA2)
Net-(U8-3): U8.3 U10.3 U12.46(3V3)
Net-(U8-4): U8.4 U10.4 U12.45(23_PWM_A9_CRX1_MCLK1)
Net-(U8-5): U8.5 U10.5 U12.44(22_PWM_A8_CTX1)
Net-(U8-7): U8.7 U10.7 U12.42(20_A6_TX5_LRCLK1)
Net-(U8-14): U8.14 U10.14 U12.35(13_PWM_SCK_CRX1_LED)
Net-(U9-2): U9.2 U10.22 U12.27(35_DAT0_MOSI2)
Net-(U9-4): U9.4 U10.24 U12.25(33_PWM_MCLK2)

Not connected (* = marked no-connect by the designer): H6 2* 3* 4* 5* 6* 8* 9* 10*; H7 1* 2* 3* 4* 5* 6* 8* 9* 10*; J2 19* MH1* MH2*; P2 2(D9)* 3(D10)* 4(D11)* 5(D12)* 6(D13)* 8(AREF)* 9(SDA)* 10(SCL)* 25(POWER)* 27(RESET)* 28(3V3)* 32(VIN)*; P3 1(D8)* 2(D9)* 3(D10)* 4(D11)* 5(D12)* 6(D13)* 8(AREF)* 9(SDA)* 10(SCL)* 14(D3)* 15(D4)* 16(D5)* 17(D6)* 18(D7)* 25(POWER)* 27(RESET)* 28(3V3)* 32(VIN)*; P6 1* 5* 6* 8*; P7 1* 5* 6* 8*; P8 4* 5* 6* 7* 8*; RJ1 7(NC)*; U3 1(NC)* 4(IN B)* 5(OUT B#)* 8(NC)*; U13 1*; U20 1(ADDR)* 2(ALERT/RDY)* 6(AIN2)* 7(AIN3)*; U900 5(n.c.)* 8(MISO/RxD3)* 9(_Reset)* 11(CANTX//)* 12(CAN2RX)* 13(TxD3)* 18(TxD2//)* 19(RxD2//)* 23(PPS)* 24(CAN2TX//)* 25(TD+)* 26(RD+)* 27(TD-)* 28(RD-)*

## Notes on the sheets
sheet 1
- Power Input/Converters
- POWERON
sheet 2
- WAS Circuit
- for ADS - MCP6002 Teensy A/D board
sheet 3
- MOTOR/VALVE CONTROL
- PWM2
- Engage 6/2
sheet 5
- Option: Bynav-C1
sheet 6
- Input Switches
- only for
- the holes
- only for
- the holes
- Speedpulse Out
sheet 7
- Main Connectors, just pick the one you want
sheet 8
- Dual CANBUS
sheet 10
- PRESSURE/CURRENT CIRCUIT
